# Altium project ArgoFC.PrjPcb (part 1 of 3)
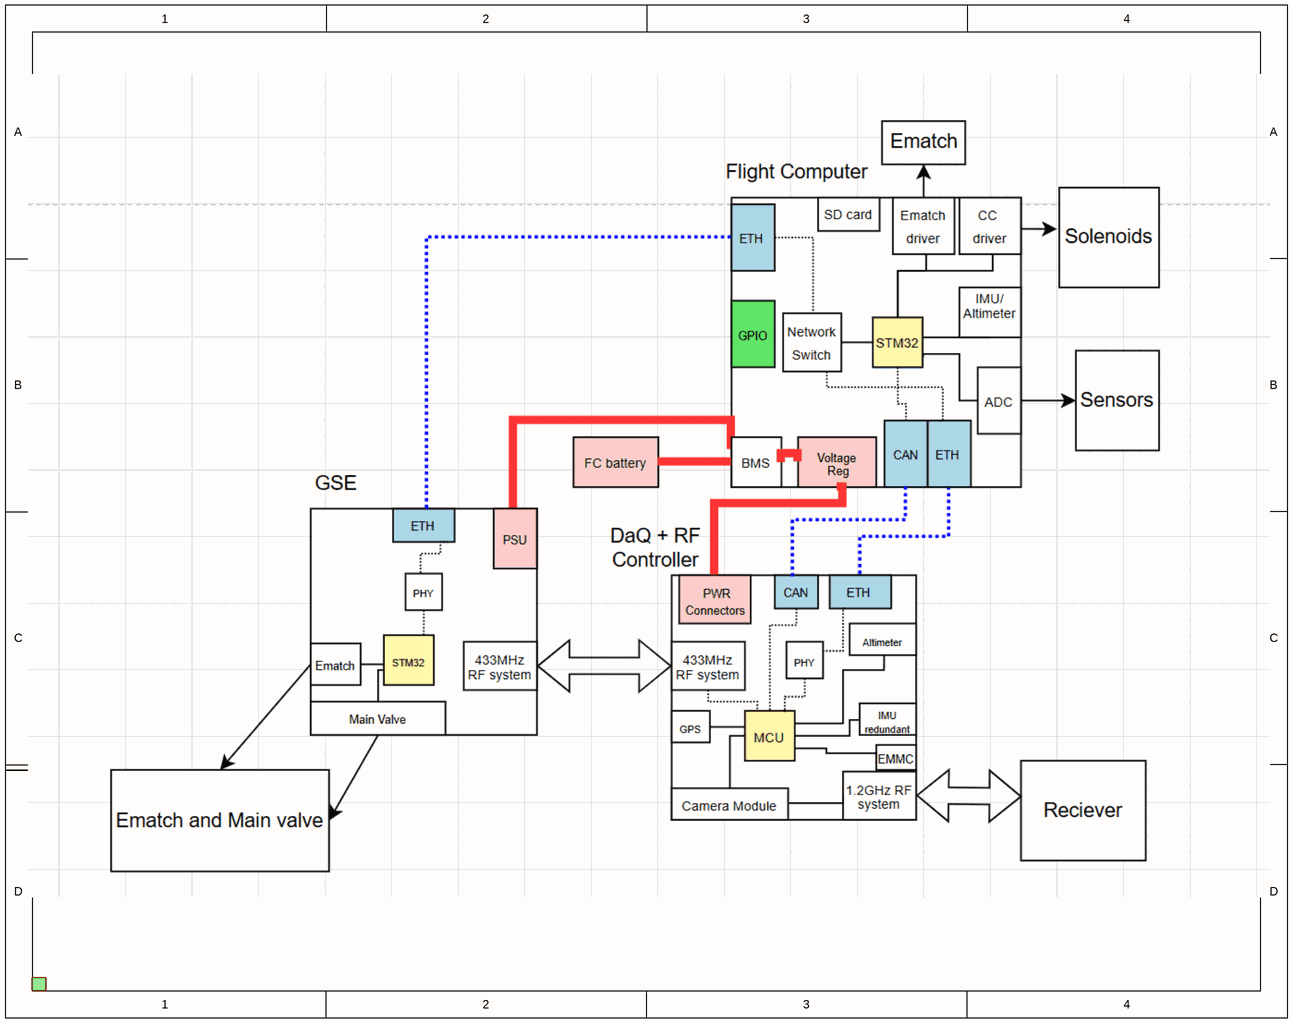
[diagram p0: CoverSheet.SchDoc]
13 sheets, 389 parts. Net scope: hierarchical (ports join the sheet entries above them; power ports are global).
Board file: ArgoFC.PcbDoc
Sheets:
  CoverSheet.SchDoc
    U_TopSheet = TopSheet.SchDoc
      U_STM32 = STM32.SchDoc
      AD7173adcModule = AD7173adcModule.SchDoc
      FlashMemory = FlashMemorySchDoc.SchDoc
      U_LoadSwitches = LoadSwitches.SchDoc
        SolenoidDriver1 = CCSolenoidDriver.SchDoc
        SolenoidDriver2 = CCSolenoidDriver.SchDoc
        SolenoidDriver3 = CCSolenoidDriver.SchDoc
        SolenoidDriver4 = CCSolenoidDriver.SchDoc
        PyroDriver1 = 24VloadSwitch.SchDoc
        PyroDriver2 = 24VloadSwitch.SchDoc
        PyroDriver3 = 24VloadSwitch.SchDoc
      U_PowerManagementModule = PowerManagementModule.SchDoc
      Designator = BoardIOModule.SchDoc
      BMS = BatteryManagementSystem.SchDoc
      Designator = CAN_Module.SchDoc
      U_KSZ8863EthernetSwitch_RMII = KSZ8863EthernetSwitch_RMII.SchDoc

## Sheet CoverSheet.SchDoc: Icarus Flight Computer
size A; Date: 11/30/2022; Revision: PRE RELEASE -- DO NOT USE; SheetNumber: 1; SheetTotal: 13

### Sub-sheets
U_TopSheet = TopSheet.SchDoc: no entries

## Sheet TopSheet.SchDoc: Icarus Flight Computer
size A; DrawnBy: J. Sullivan; Organization: ORGANIZATION; Address1: ADDRESS 1; Address2: ADDRESS 2; Address3: ADDRESS 3; Address4: ADDRESS 4; Revision: -; SheetNumber: 2; SheetTotal: 13; ENG_APP_DATE: 07/28/22; DSN_APP_DATE: --/--/--; CHK_APP_DATE: --/--/--
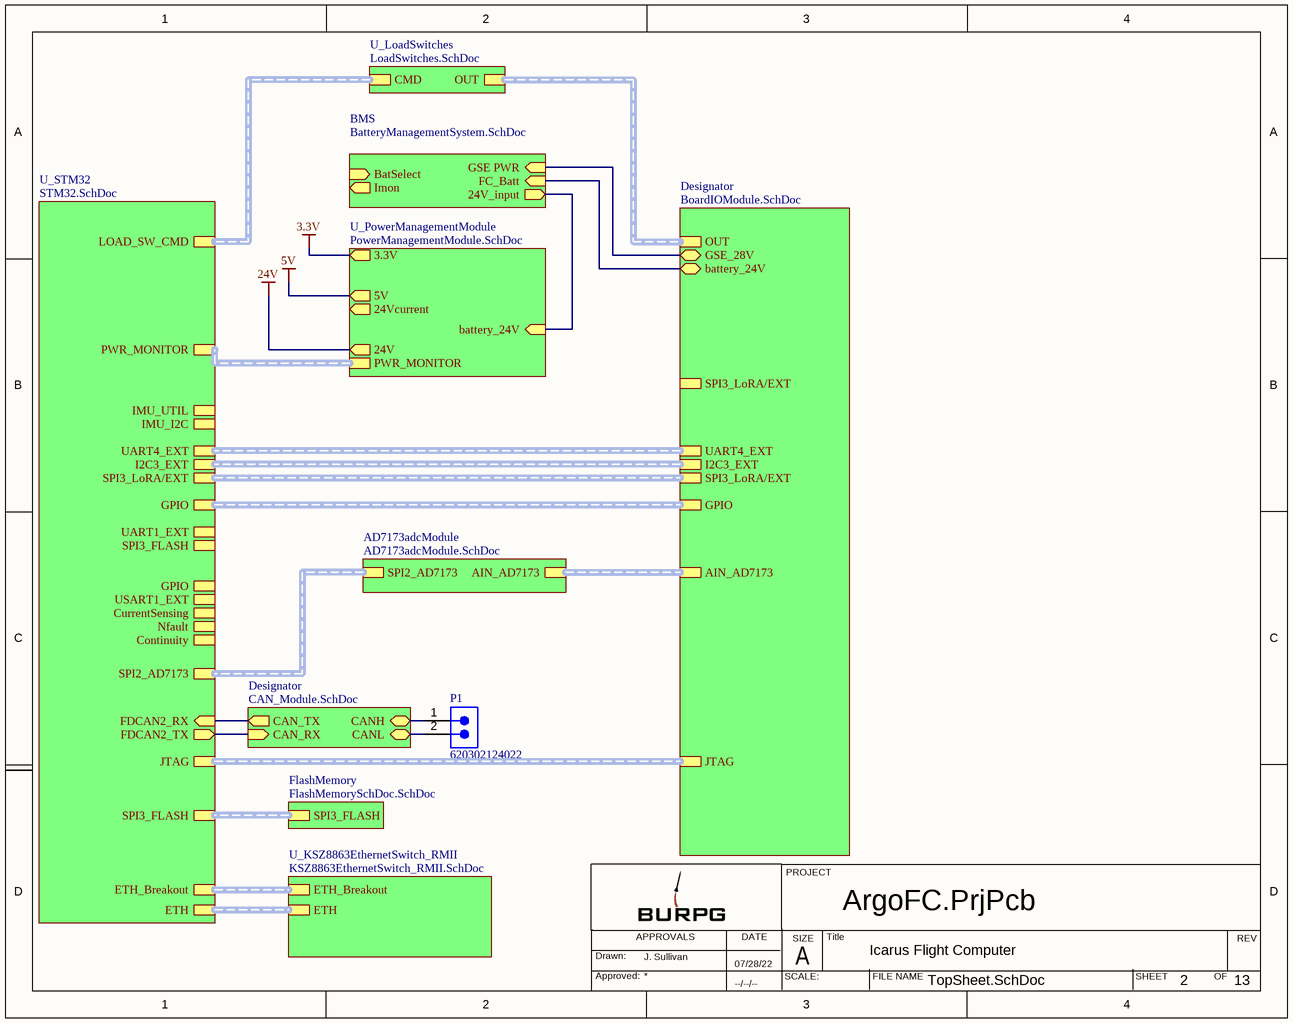
[diagram p1: TopSheet.SchDoc]

### Parts
P1  620302124022  [620302124022]

### Sub-sheets
AD7173adcModule = AD7173adcModule.SchDoc: SPI2_AD7173 (harness SPI), AIN_AD7173 (harness AIN_AD7173)
BMS = BatteryManagementSystem.SchDoc: GSE PWR (in), 24V_input (out), FC_Batt (in), BatSelect (in), Imon (out)
Designator = BoardIOModule.SchDoc: OUT (harness LOAD_SW_OUT), I2C3_EXT (harness I2C), UART4_EXT (harness UART), AIN_AD7173 (harness AIN_AD7173), SPI3_LoRA/EXT (harness SPI), JTAG (harness JTAG), GPIO, battery_24V (bidir), GSE_28V (bidir), SPI3_LoRA/EXT (harness SPI_EXT)
Designator = CAN_Module.SchDoc: CANH (bidir), CANL (bidir), CAN_RX (in), CAN_TX (out)
FlashMemory = FlashMemorySchDoc.SchDoc: SPI3_FLASH (harness LOAD_SW)
U_KSZ8863EthernetSwitch_RMII = KSZ8863EthernetSwitch_RMII.SchDoc: ETH (harness ETH), ETH_Breakout (harness SPI_ENC28J60)
U_LoadSwitches = LoadSwitches.SchDoc: CMD (harness LOAD_SW_CMD), OUT (harness LOAD_SW_OUT)
U_PowerManagementModule = PowerManagementModule.SchDoc: battery_24V (in), 24V (out), 3.3V (out), PWR_MONITOR (harness PWR_MONITOR), 24Vcurrent (out), 5V (out)
U_STM32 = STM32.SchDoc: JTAG (harness JTAG), PWR_MONITOR (harness PWR_MONITOR), UART4_EXT (harness UART), SPI3_FLASH (harness SPI), SPI2_AD7173 (harness SPI), LOAD_SW_CMD (harness LOAD_SW), IMU_I2C (harness I2C), I2C3_EXT (harness I2C), SPI3_LoRA/EXT (harness SPI), IMU_UTIL (harness IMUs), GPIO (harness *), UART1_EXT (harness UART4), SPI3_FLASH (harness SPI_FLASH), GPIO (harness GPIO), USART1_EXT (harness UART8), CurrentSensing (harness LOAD_Isense), Nfault (harness Nf), Continuity (harness Continuity), FDCAN2_RX (in), FDCAN2_TX (out), ETH (harness ETH), ETH_Breakout (harness SPI_ENC28J60)

### Nets
CANH: P1.1 ; sheet Designator/CANH
CANL: P1.2 ; sheet Designator/CANL
FDCAN2_RX: sheet U_STM32/FDCAN2_RX, sheet Designator/CAN_TX
FDCAN2_TX: sheet U_STM32/FDCAN2_TX, sheet Designator/CAN_RX
NetBMS1_7: sheet Designator/battery_24V, sheet BMS/FC_Batt
NetBMS1_9: sheet Designator/GSE_28V, sheet BMS/GSE PWR
NetC3_1: sheet U_PowerManagementModule/battery_24V, sheet BMS/24V_input

### Buses and harness runs
harness sheet AD7173adcModule/AIN_AD7173 = sheet Designator/AIN_AD7173
harness sheet AD7173adcModule/SPI2_AD7173 = sheet U_STM32/SPI2_AD7173
harness sheet Designator/GPIO = sheet U_STM32/GPIO
harness sheet Designator/I2C3_EXT = sheet U_STM32/I2C3_EXT
harness sheet Designator/JTAG = sheet U_STM32/JTAG
harness sheet Designator/OUT = sheet U_LoadSwitches/OUT
harness sheet Designator/SPI3_LoRA/EXT = sheet U_STM32/SPI3_LoRA/EXT
harness sheet Designator/UART4_EXT = sheet U_STM32/UART4_EXT
harness sheet FlashMemory/SPI3_FLASH = sheet U_STM32/SPI3_FLASH
harness sheet U_KSZ8863EthernetSwitch_RMII/ETH = sheet U_STM32/ETH
harness sheet U_KSZ8863EthernetSwitch_RMII/ETH_Breakout = sheet U_STM32/ETH_Breakout
harness sheet U_LoadSwitches/CMD = sheet U_STM32/LOAD_SW_CMD
harness sheet U_PowerManagementModule/PWR_MONITOR = sheet U_STM32/PWR_MONITOR

### Notes on the sheet
- PROJECT
- Drawn:
- Approved:
- APPROVALS
- DATE
- SCALE:
- SIZE
- A
- Title
- FILE NAME
- SHEET
- OF
- REV

### Library data of the parts
P1 = CMP-1502-00660-2: NexarPartId: 18818242; Insulation: Insulated; Connector Type: Male Pin; Pitch: 2mm; Insulation Resistance: 1GΩ; Gender: Male; Voltage Rating: 125V; Number of Positions: 2; Contact Resistance: 20mΩ; Operating Supply Voltage: 100V; Current Rating: 2A; Contact Material: Copper; Number of Rows: 1; Flammability Rating: UL94 V-0; Housing Material: Nylon; Lead Pitch: 2mm; Orientation: Vertical; Max Operating Temperature: 85°C; Termination: SMD/SMT; REACH SVHC: Unknown; Contact Mating Length: 3.5052mm; RoHS: Compliant; Packaging: Tape and Reel; Number of Contacts: 2; Height: 6.6mm; Mount: Surface Mount; Number of Pins: 2; Contact Gender: Male; Min Operating Temperature: -40°C; Length: 5mm; Width: 7.9mm; Contact Plating: Tin; Color: Beige, White

## Sheet STM32.SchDoc: Icarus MCU
size 431 x 279 mm; Date: 12/1/2022; DrawnBy: J. Sullivan; SheetNumber: 3; SheetTotal: 13; ENG_APP_DATE: 12/01/2022; DSN_APP_DATE: --/--/--; CHK_APP_DATE: --/--/--; SPICEModelCacheYFKOITNE: <root> / <DocumentId>YFKOITNE</DocumentId> / </root>
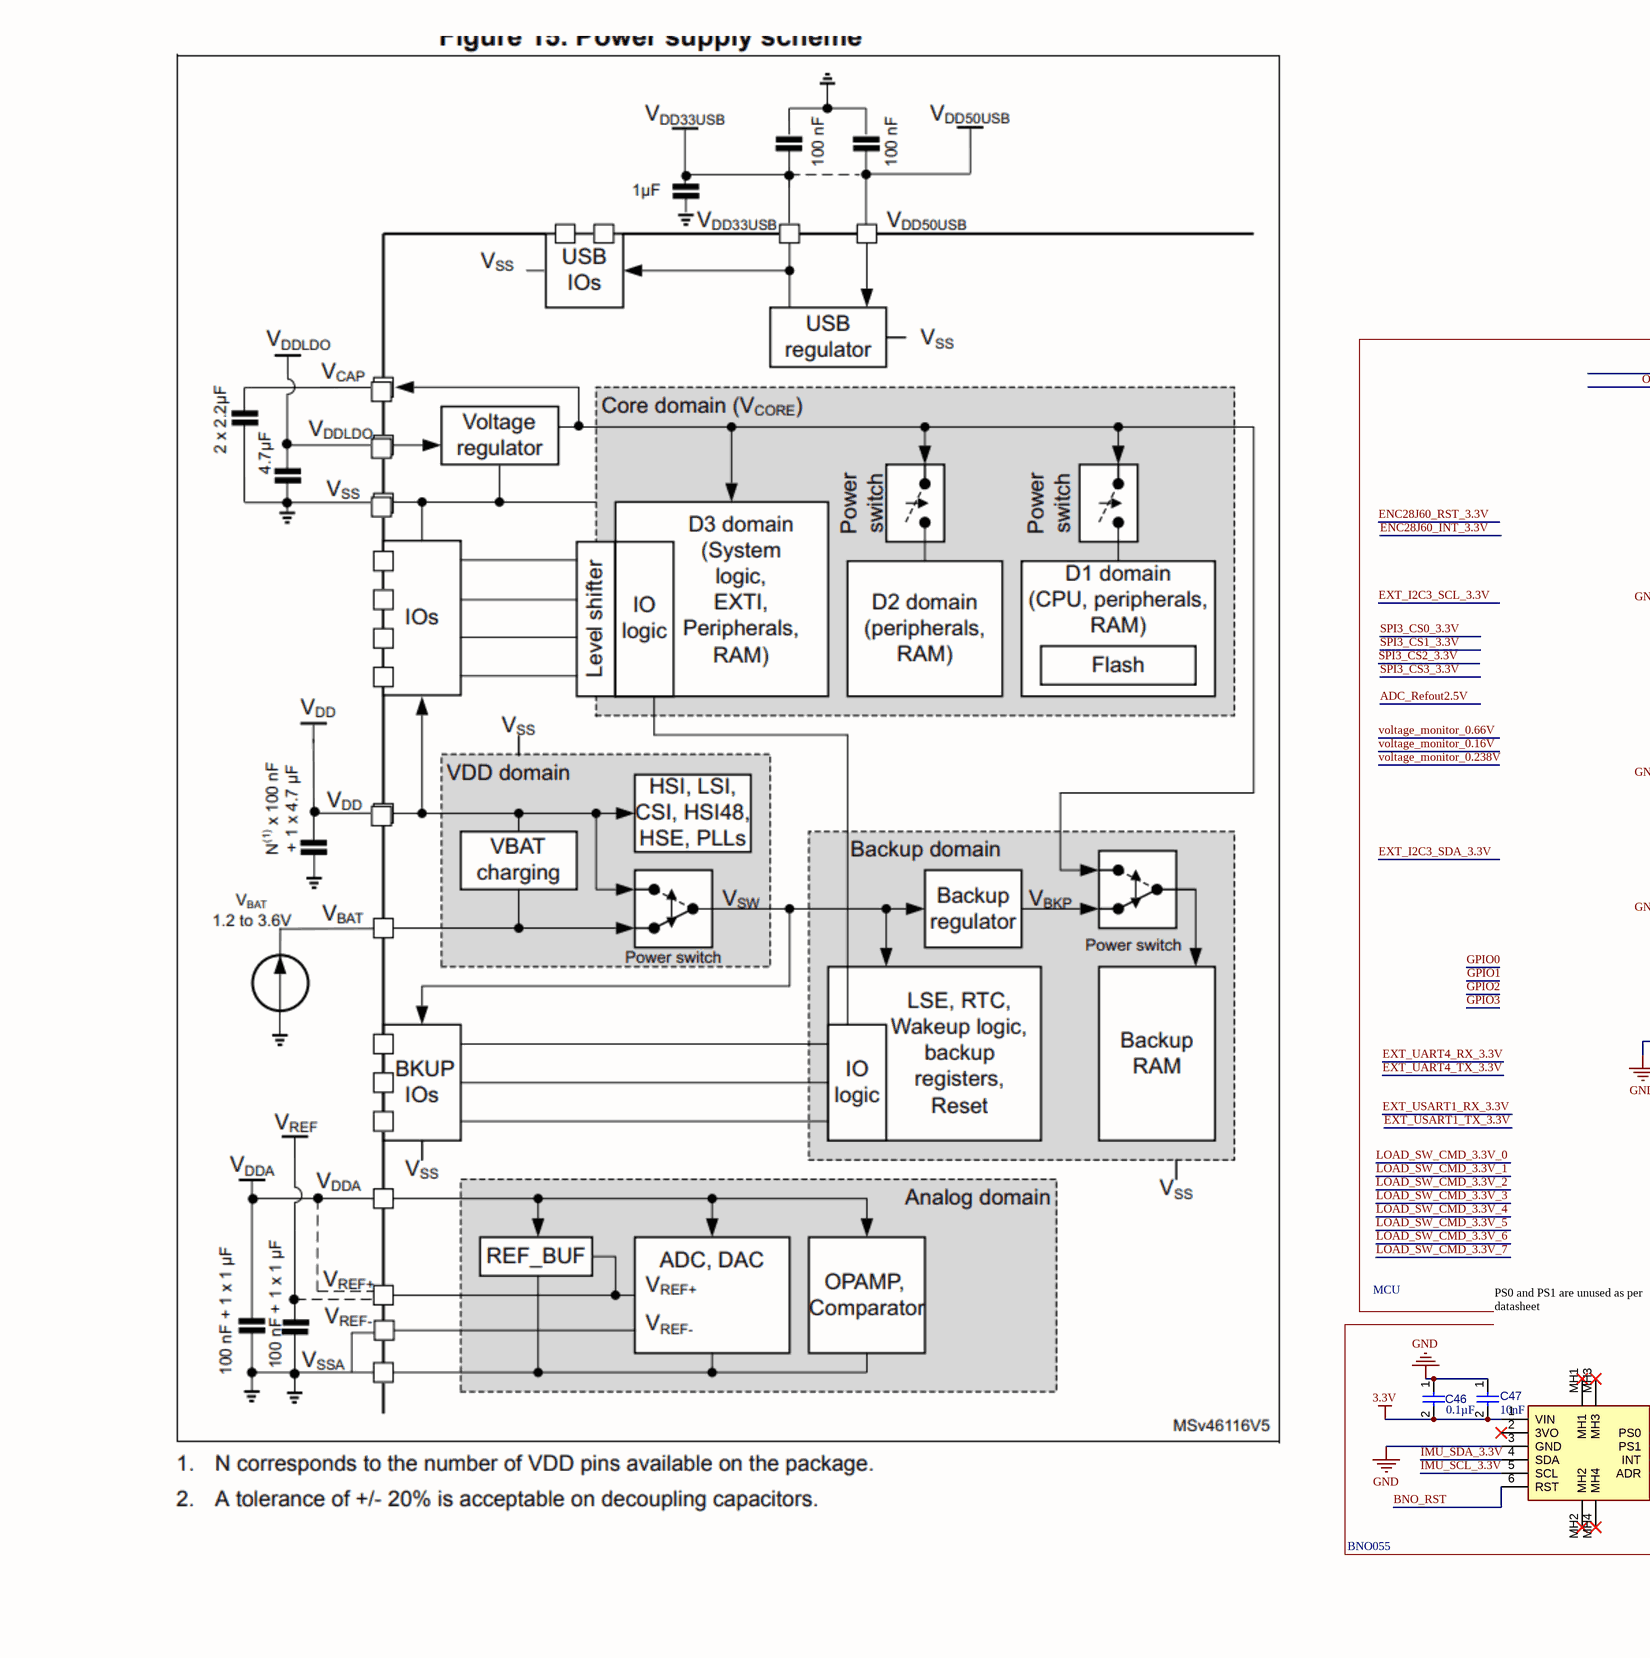
[diagram p2: STM32.SchDoc, left]
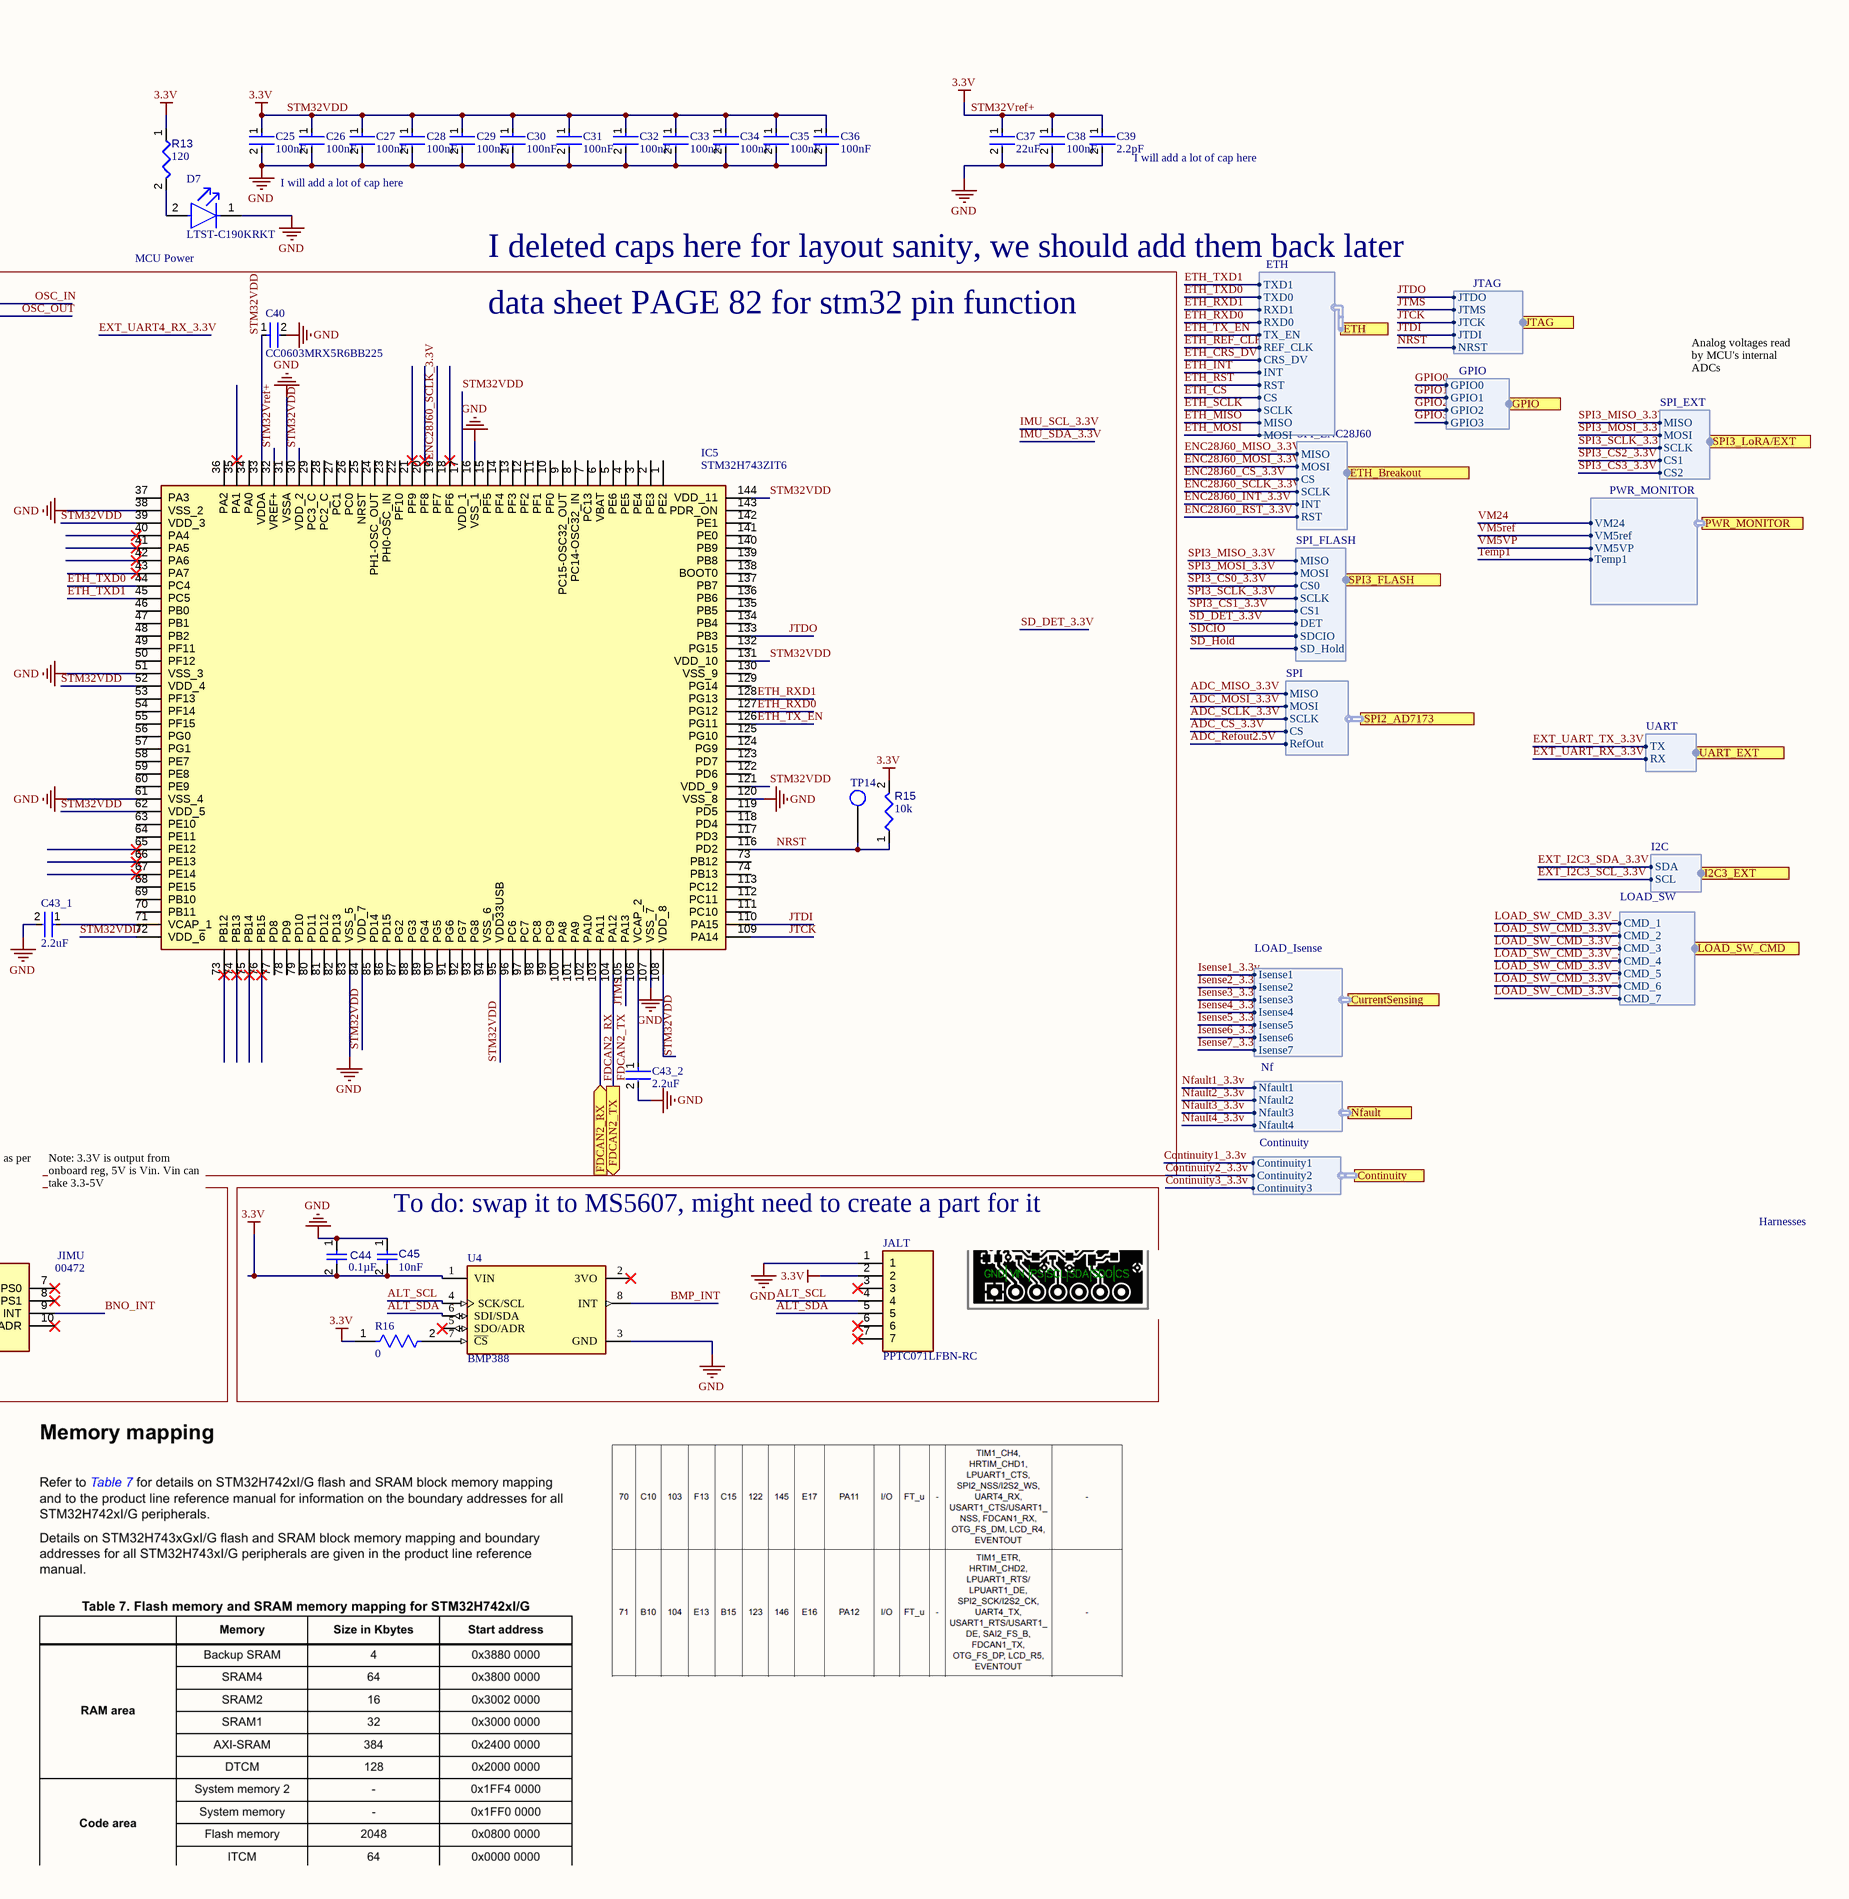
[diagram p3: STM32.SchDoc, right]

### Parts
C25  100nF  [FP-CC0402-MFG]
C26  100nF  [FP-CC0402-MFG]
C27  100nF  [FP-CC0402-MFG]
C28  100nF  [FP-CC0402-MFG]
C29  100nF  [FP-CC0402-MFG]
C30  100nF  [FP-CC0402-MFG]
C31  100nF  [FP-CC0402-MFG]
C32  100nF  [FP-CC0402-MFG]
C33  100nF  [FP-CC0402-MFG]
C34  100nF  [FP-CC0402-MFG]
C35  100nF  [FP-CC0402-MFG]
C36  100nF  [FP-CC0402-MFG]
C37  22uF  [FP-CC0603-DA-MFG]
C38  100nF  [FP-CGA3E-0_3-0_1-IPC_A]
C39  2.2pF  [FP-C0603C-CF-MFG]
C40  CC0603MRX5R6BB225  [FP-CC0603-DA-MFG]
C43_1  2.2uF  [FP-CC0603-DA-MFG]
C43_2  2.2uF  [FP-CC0603-DA-MFG]
C44  value 0.1µF  [CAPC1608X90X40LL10T20]  (hidden comment: Capacitor 1 uF +/- 10% 25 V 0603)
C45  value 10nF  [CAPC1608X90X40NL10T20]  (hidden comment: Capacitor 100 nF +/-10% 50 V 0603)
C46  value 0.1µF  [CAPC1608X90X40LL10T20]  (hidden comment: Capacitor 1 uF +/- 10% 25 V 0603)
C47  value 10nF  [CAPC1608X90X40NL10T20]  (hidden comment: Capacitor 100 nF +/-10% 50 V 0603)
D7  LTST-C190KRKT  [FP-LTST-C190KRKT-MFG]
IC5  STM32H743ZIT6  [QFP50P2200X2200X160-144N]
JALT  PPTC071LFBN-RC  [RHDR7W80P0X254_1X7_1828X254X870P]
JIMU  00472  [00472]
R13  value 120  [RESC1609X50X30ML08T20]  (hidden comment: Resistor 20R +/-1% 0603 100 mW)
R15  value 10k  [RESC0402(1005)_L]  (hidden comment: 10KR2F)
R16  0  [FP-CRCW1206-e3-MFG]
TP14  BURPG_TestPoint1  [BURPG_TestPoint1]  (value not drawn)  (no BOM)
U4  BMP388  [FP-3966-MFG]

### Blocks framed on the sheet
data sheet PAGE 82 for stm32 pin function: C40 C43_1 C43_2 IC5 R15 TP14
BNO055: C46 C47 JIMU
To do: swap it to MS5607, might need to create a part for it: C44 C45 JALT R16 U4

### Ports
Continuity (harness Continuity), CurrentSensing (harness LOAD_Isense), ETH (harness ETH), ETH_Breakout (harness SPI_ENC28J60), FDCAN2_RX (in), FDCAN2_TX (out), GPIO (harness GPIO), I2C3_EXT (harness I2C), JTAG (harness JTAG), LOAD_SW_CMD (harness LOAD_SW), Nfault (harness Nf), PWR_MONITOR (harness PWR_MONITOR), SPI2_AD7173 (harness SPI), SPI3_FLASH (harness SPI_FLASH), SPI3_LoRA/EXT (harness SPI_EXT), UART_EXT (harness UART)

### Harnesses
JTAG: JTDO, JTMS, JTCK, JTDI, NRST
UART: TX, RX
SPI_ENC28J60: MISO, MOSI, CS, SCLK, INT, RST
LOAD_SW: CMD_1, CMD_2, CMD_3, CMD_4, CMD_5, CMD_6, CMD_7
I2C: SDA, SCL
SPI_EXT: MISO, MOSI, CS1, SCLK, CS2
PWR_MONITOR: VM24, VM5ref, VM5VP, Temp1
GPIO: GPIO0, GPIO1, GPIO2, GPIO3
SPI_FLASH: MISO, MOSI, CS0, SCLK, CS1, DET, SDCIO, SD_Hold
SPI: MISO, MOSI, CS, SCLK, RefOut
LOAD_Isense: Isense1, Isense2, Isense3, Isense4, Isense5, Isense6, Isense7
Nf: Nfault1, Nfault2, Nfault3, Nfault4
Continuity: Continuity1, Continuity2, Continuity3
ETH: RXD0, RXD1, TXD0, TXD1, TX_EN, REF_CLK, CRS_DV, INT, RST, CS, SCLK, MISO, MOSI

### Nets
GND: C25.2 C26.2 C27.2 C28.2 C29.2 C30.2 C31.2 C32.2 C33.2 C34.2 C35.2 C36.2 C37.2 C38.2 C39.2 C40.2 C43_1.2 C43_2.2 C44.1 C45.1 C46.1 C47.1 D7.1(C) IC5.16(VSS_1) IC5.31(VSSA) IC5.38(VSS_2) IC5.51(VSS_3) IC5.61(VSS_4) IC5.83(VSS_5) IC5.107(VSS_7) IC5.120(VSS_8) JALT.1 JIMU.3(GND) U4.3(GND)
STM32VDD: C25.1 C26.1 C27.1 C28.1 C29.1 C30.1 C31.1 C32.1 C33.1 C34.1 C35.1 C36.1 C37.1 C38.1 C39.1 C40.1 C44.2 C45.2 C46.2 C47.2 IC5.17(VDD_1) IC5.30(VDD_2) IC5.32(VREF+) IC5.33(VDDA) IC5.39(VDD_3) IC5.52(VDD_4) IC5.62(VDD_5) IC5.72(VDD_6) IC5.84(VDD_7) IC5.95(VDD33USB) IC5.108(VDD_8) IC5.121(VDD_9) IC5.131(VDD_10) IC5.144(VDD_11) JALT.2 JIMU.1(VIN) R13.1 R15.2 R16.1 U4.1(VIN)  [also labelled 3.3V, STM32Vref+]
ALT_SCL: JALT.4 U4.4(SCK/SCL)
ALT_SDA: JALT.5 U4.6(SDI/SDA)
BMP_INT: U4.8(INT)
BNO_INT: JIMU.9(INT)
BNO_RST: JIMU.6(RST)
Continuity1_3.3v: port Continuity.Continuity1
Continuity2_3.3v: port Continuity.Continuity2
Continuity3_3.3v: port Continuity.Continuity3
ENC28J60_SCLK_3.3V: IC5.19(PF7) ; port ETH_Breakout.SCLK
ETH_CS: port ETH.CS
ETH_INT: port ETH.INT
ETH_MISO: port ETH.MISO
ETH_MOSI: port ETH.MOSI
ETH_RST: port ETH.RST
ETH_RXD0: IC5.127(PG12) ; port ETH.RXD0
ETH_RXD1: IC5.128(PG13) ; port ETH.RXD1
ETH_SCLK: port ETH.SCLK
ETH_TX_EN: IC5.126(PG11) ; port ETH.TX_EN
ETH_TXD0: IC5.44(PC4) ; port ETH.TXD0
ETH_TXD1: IC5.45(PC5) ; port ETH.TXD1
EXT_I2C3_SCL_3.3V: port I2C3_EXT.SCL
EXT_I2C3_SDA_3.3V: port I2C3_EXT.SDA
EXT_UART_RX_3.3V: port UART_EXT.RX
EXT_UART_TX_3.3V: port UART_EXT.TX
FDCAN2_RX: IC5.103(PA11) ; port FDCAN2_RX
FDCAN2_TX: IC5.104(PA12) ; port FDCAN2_TX
IMU_SCL_3.3V: JIMU.5(SCL)
IMU_SDA_3.3V: JIMU.4(SDA)
Isense1_3.3v: port CurrentSensing.Isense1
Isense2_3.3v: port CurrentSensing.Isense2
Isense3_3.3v: port CurrentSensing.Isense3
Isense4_3.3v: port CurrentSensing.Isense4
Isense5_3.3v: port CurrentSensing.Isense5
Isense6_3.3v: port CurrentSensing.Isense6
Isense7_3.3v: port CurrentSensing.Isense7
JTCK: IC5.109(PA14) ; port JTAG.JTCK
JTDI: IC5.110(PA15) ; port JTAG.JTDI
JTDO: IC5.133(PB3) ; port JTAG.JTDO
JTMS: IC5.105(PA13) ; port JTAG.JTMS
Nfault1_3.3v: port Nfault.Nfault1
Nfault2_3.3v: port Nfault.Nfault2
Nfault3_3.3v: port Nfault.Nfault3
Nfault4_3.3v: port Nfault.Nfault4
NRST: IC5.116(PD2) R15.1 TP14.1 ; port JTAG.NRST
SPI3_CS2_3.3V: port SPI3_LoRA/EXT.CS1
SPI3_CS3_3.3V: port SPI3_LoRA/EXT.CS2
SPI3_MISO_3.3V: port SPI3_LoRA/EXT.MISO, port SPI3_FLASH.MISO
SPI3_MOSI_3.3V: port SPI3_LoRA/EXT.MOSI, port SPI3_FLASH.MOSI
SPI3_SCLK_3.3V: port SPI3_LoRA/EXT.SCLK, port SPI3_FLASH.SCLK
VM5ref: port PWR_MONITOR.VM5ref
VM5VP: port PWR_MONITOR.VM5VP
NetC43_1_1: C43_1.1 IC5.71(VCAP_1)
NetC43_2_1: C43_2.1 IC5.106(VCAP_2)
NetD7_2: D7.2(A) R13.2
NetR16_2: R16.2 U4.7(~{CS})

Not connected (* = marked no-connect by the designer): IC5 1(PE2) 2(PE3) 3(PE4) 4(PE5) 5(PE6) 6(VBAT) 7(PC13) 8(PC14-OSC32_IN) 9(PC15-OSC32_OUT) 10(PF0) 11(PF1) 12(PF2) 13(PF3) 14(PF4) 15(PF5) 18(PF6)* 20(PF8)* 21(PF9)* 22(PF10) 23(PH0-OSC_IN) 24(PH1-OSC_OUT) 25(NRST) 26(PC0) 27(PC1) 28(PC2_C) 29(PC3_C) 34(PA0) 35(PA1)* 36(PA2) 37(PA3) 40(PA4)* 41(PA5)* 42(PA6)* 43(PA7)* 46(PB0) 47(PB1) 48(PB2) 49(PF11) 50(PF12) 53(PF13) 54(PF14) 55(PF15) 56(PG0) 57(PG1) 58(PE7) 59(PE8) 60(PE9) 63(PE10) 64(PE11) 65(PE12)* 66(PE13)* 67(PE14)* 68(PE15) 69(PB10) 70(PB11) 73(PB12)* 74(PB13)* 75(PB14)* 76(PB15)* 77(PD8) 78(PD9) 79(PD10) 80(PD11) 81(PD12) 82(PD13) 85(PD14) 86(PD15) 87(PG2) 88(PG3) 89(PG4) 90(PG5) 91(PG6) 92(PG7) 93(PG8) 94(VSS_6) 96(PC6) 97(PC7) 98(PC8) 99(PC9) 100(PA8) 101(PA9) 102(PA10) 111(PC10) 112(PC11) 113(PC12) 117(PD3) 118(PD4) 119(PD5) 122(PD6) 123(PD7) 124(PG9) 125(PG10) 129(PG14) 130(VSS_9) 132(PG15) 134(PB4) 135(PB5) 136(PB6) 137(PB7) 138(BOOT0) 139(PB8) 140(PB9) 141(PE0) 142(PE1) 143(PDR_ON); JALT 3* 6* 7*; JIMU 2(3VO)* 7(PS0)* 8(PS1)* 10(ADR)* MH1* MH2* MH3* MH4*; U4 2(3VO)* 5(SDO/ADR)*

### Notes on the sheet
- I will add a lot of cap here
- (near C39) I will add a lot of cap here
- (near D7) MCU Power
- I deleted caps here for layout sanity, we should add them back later
- Analog voltages read by MCU's internal ADCs
- MCU
- PS0 and PS1 are unused as per datasheet
- Note: 3.3V is output from onboard reg, 5V is Vin. Vin can take 3.3-5V
- Harnesses
- DWG. NO.
- REV.
- SHT.
- THIS DOCUMENT AND THE DATA DISCLOSED HEREIN OR HEREWITH IS THE PROPERTY OF ALTIUM LIMITED AND MAY BE FREELY DISTRIBUTED IN WHOLE. NO RIGHTS ARE RESERVED OR EXPRESS OR IMPLIED WARANTEE GIVEN.
- REVISION
- DESCRIPTION
- DATE
- APPROVED
- ENG:
- APPROVALS
- PROJECT
- DSN:
- CHK:
- REFERENCE DOCUMENTS
- PROJECT REVISION:
- TITLE
- DOCUMENT REVISION:
- DESIGN ITEM:
- BOM:
- FAB DWG:
- PCB DWG:
- ASSY DWG:
- SCALE:
- SIZE
- B
- CAGE CODE
- FILE NAME
- DWG NO.
- SHEET
- OF
- REV

### Library data of the parts
C25-C36 = CMP-03422-000048-1: CAP CER 0.1UF 16V X7R 0402; Manufacturer: YAGEO; Manufacturer Part Number: CC0402KRX7R7BB104; Material: Ceramic; Automotive Grade: NA; Temperature Coefficient: 30ppm/°C; Tolerance: 0.1; Device Class L1: Passive Components; Temperature Range Low: -55°C; Device Class L3: Ceramic Capacitors; Temperature Characteristic: X7R; Ipc Land Pattern Name: CAPC10050X50; Capacitance: 100 nF; Temperature Range High: +125°C; Voltage Rating: 16 V; Temperature: -55°C to +125°C; RoHS: TRUE; Automotive: No; Height: 0.55mm; Device Class L2: Capacitors; Digikey Description: CAP CER 0.1UF 16V X7R 0402; Package: CC0402; Footprint Url: http://www.yageo.com/exep/pages/download/literatures/UPY-C_GEN_24.pdf; ComponentLink2Description: Datasheet; Category: Cap; Lead Free: Yes; Value: 100 nF; Octopart: https://octopart.com/cc0402krx7r7bb104-yageo-42244624; ComponentLink2URL: http://www.yageo.com/documents/recent/UPY-GP_NP0_16V-to-50V_16.pdf; Mouser Description: 0402 0.1 uF 16 V ±10 % Tolerance X7R SMT Multilayer Ceramic Capacitor
C37 C43_1 C43_2 = CMP-03422-000441-1: CAP CER 2.2UF 10V X5R 0603; Manufacturer Part Number: CC0603MRX5R6BB225; Manufacturer: YAGEO; Material: Ceramic; Tolerance: 0.2; Temperature Coefficient: 15%; Temperature Characteristic: X5R; Device Class L2: Capacitors; Octopart: https://octopart.com/cc0603mrx5r6bb225-yageo-40952238; Digikey Description: CAP CER 2.2UF 10V X5R 0603; Footprint Url: http://www.yageo.com/exep/pages/download/literatures/UPY-C_GEN_24.pdf; ComponentLink2URL: http://www.yageo.com/documents/recent/UPY-GPHC_X7R_6.3V-to-50V_18.pdf; ComponentLink2Description: Datasheet; Device Class L1: Passive Components; Height: 0.9mm; Category: Cap; Device Class L3: Ceramic Capacitors; Temperature Range High: +125°C; Value: 2.2 uF; Automotive: No; Package: CC0603-DA; Mouser Description: Multilayer Ceramic Capacitors MLCC - SMD/SMT 2.2uF 10V X5R 20%; Temperature: -55°C to +125°C; Temperature Range Low: -55°C; RoHS: TRUE; Lead Free: Yes; Voltage Rating: 10 V; Capacitance: 2.2 uF; Voltage: 10 V
C38 = CMP-2000-07546-2: Cap Ceramic 100nF 50V X7R 10% Pad SMD 0603 +125°C Automotive T/R; Weight: 7.1E-05oz; Composition: Ceramic; Max Operating Temperature: 125°C; Termination: SMD/SMT; Dielectric: X7R; Length: 1.6mm; Package Quantity: 1; REACH SVHC: No SVHC; Lead Free: Lead Free; Case Code (Metric): 1608; Min Operating Temperature: -55°C; Packaging: Tape and Reel; Tolerance: 10%; Voltage Rating: 50V; Case Code (Imperial): 0603; Capacitance: 100nF; Case/Package: 0603; Voltage Rating (DC): 50V; Depth: 0.8mm; Radiation Hardening: No; Ratings: AEC-Q200; Mount: Surface Mount; Voltage: 50V; Thickness: 0.035inch; Width: 0.8mm; Height: 0.8mm
C39 = CMP-1035-00158-3: CAP CER 2.2PF 50V NP0 0603; Manufacturer Part Number: C0603C229C5GACTU; Manufacturer: KEMET; Automotive Grade: Grade 1; Temperature Coefficient: 30ppm/°C; Temperature Characteristic: C0G; Tolerance: 0.25 pF; Material: Ceramic; Lead Free: Yes; Value: 2.2 pF; Voltage Rating: 50 V; Package: C0603C-CF; Category: Cap; RoHS: TRUE; ComponentLink2Description: Datasheet; Capacitance: 2.2 pF; Device Class L2: Capacitors; Digikey Description: CAP CER 2.2PF 50V NP0 0603; Temperature: -55°C to +125°C; Temperature Range Low: -55°C; Mouser Description: Multilayer Ceramic Capacitors MLCC - SMD/SMT 50volts 2.2pF C0G 0.25%; ComponentLink2URL: https://api.kemet.com/component-edge/download/datasheet/C0603C100J5GACAUTO.pdf; Temperature Range High: +125°C; Height: 0.87mm; Automotive: Yes; Device Class L1: Passive Components; Octopart: https://octopart.com/c0603c229c5gactu-kemet-3874912; Device Class L3: Ceramic Capacitors
C40 = CMP-03422-000441-1: CAP CER 2.2UF 10V X5R 0603; Manufacturer: YAGEO; Material: Ceramic; Tolerance: 0.2; Temperature Coefficient: 15%; Temperature Characteristic: X5R; Device Class L2: Capacitors; Octopart: https://octopart.com/cc0603mrx5r6bb225-yageo-40952238; Digikey Description: CAP CER 2.2UF 10V X5R 0603; Footprint Url: http://www.yageo.com/exep/pages/download/literatures/UPY-C_GEN_24.pdf; ComponentLink2URL: http://www.yageo.com/documents/recent/UPY-GPHC_X7R_6.3V-to-50V_18.pdf; ComponentLink2Description: Datasheet; Device Class L1: Passive Components; Height: 0.9mm; Category: Cap; Device Class L3: Ceramic Capacitors; Temperature Range High: +125°C; Value: 2.2 uF; Manufacturer Part Number: CC0603MRX5R6BB225; Automotive: No; Package: CC0603-DA; Mouser Description: Multilayer Ceramic Capacitors MLCC - SMD/SMT 2.2uF 10V X5R 20%; Temperature: -55°C to +125°C; Temperature Range Low: -55°C; RoHS: TRUE; Lead Free: Yes; Voltage Rating: 10 V; Capacitance: 2.2 uF; Voltage: 10 V
C44 C46 = CMP-001-00005-6: Chip Capacitor, 1 uF, +/- 10%, 25 V, 0603 (1608 Metric); Capacitor Type: Ceramic; Voltage Rating: 25V; Pins: 2; Mounting Technology: SM; RoHS Compliant: True; Max Operating Temperature: 125°C; Case/Package: 0603; Min Operating Temperature: -55°C; Tolerance: 10%
C45 C47 = CMP-001-00017-6: Chip Capacitor, 100 nF, +/- 10%, 50 V, 0603 (1608 Metric); Voltage Rating: 50V; Capacitor Type: Ceramic; Tolerance: 10%; Mounting Technology: SM; Max Operating Temperature: 125°C; RoHS Compliant: True; Pins: 2; Case/Package: 0603; Min Operating Temperature: -55°C
D7 = CMP-1674-00011-2: LED RED CLEAR CHIP SMD; Reverse Voltage: 5V; Viewing Angle: 130°; Power Rating: 75mW; Test Current: 20mA; Number of Elements: 1; Lens Color: Colorless; Wavelength: 639nm; Dominant Wavelength: 631nm; Lens Style: Diffused; Forward Current: 30mA; Forward Voltage: 2.4V; Luminous Intensity: 54mcd; Color: Red; Case Code (Imperial): 0603; Lens Transparency: Clear; Lead Free: Lead Free; Package Quantity: 1; Packaging: Tape and Reel; Max Operating Temperature: 85°C; Number of Pins: 2; Height: 0.8mm; Case/Package: 0603; Number of LEDs: 1; Width: 0.8mm; Case Code (Metric): 1608; Depth: 0.8mm; Mount: Surface Mount; Radiation Hardening: No; Length: 1.6mm; Illumination Color: Red; Power Dissipation: 75mW; Min Operating Temperature: -55°C
IC5 = STM32H743ZIT6: Integrated Circuit / https://www.allelcoelec.com/productdetails/STMicroelectronics/STM32H743ZIT6.html?gad_source=1&gad_campaignid=21002909653&gclid=CjwKCAjw4efDBhATEiwAaDBpbvLpcbmne3WKOXgEcIaqaVpz5lcgSvxb9vCyHUjI6dfgnmkW9JZCHhoCY-cQAvD_BwE; Datasheet Link: https://www.st.com/resource/en/datasheet/stm32h743zi.pdf; Height: 1.6mm; Manufacturer_Name: STMicroelectronics; Manufacturer_Part_Number: STM32H743ZIT6; Mouser Part Number: 511-STM32H743ZIT6; Mouser Price/Stock: https://www.mouser.co.uk/ProductDetail/STMicroelectronics/STM32H743ZIT6?qs=FNcb6ahWXRyuf15GdgTu%252Bw%3D%3D; Arrow Part Number: STM32H743ZIT6; Arrow Price/Stock: https://www.arrow.com/en/products/stm32h743zit6/stmicroelectronics?utm_currency=USD&region=nac
JALT = PPTC071LFBN-RC: Connector; Manufacturer_Name: Sullins; Datasheet Link: https://drawings-pdf.s3.amazonaws.com/10492.pdf; Height: 8.7mm; Manufacturer_Part_Number: PPTC071LFBN-RC
JIMU = 00472: Connector; Manufacturer_Name: Adafruit; Datasheet Link: https://learn.adafruit.com/downloads/pdf/adafruit-bno055-absolute-orientation-sensor.pdf; Height: 2mm; Manufacturer_Part_Number: 00472
R13 = CMP-009-00199-1: Chip Resistor, 20 Ohm, +/- 1%, 100 mW, -55 to 155 degC, 0603 (1608 Metric); Power: 100mW; Voltage Rating: 75V; RoHS Compliant: True; Tolerance: 1%; Mounting Technology: SM; Min Operating Temperature: -55°C; Pins: 2; Max Operating Temperature: 155°C; Case/Package: 0603
R15 = CMP-009-00066-2: 10K 0.063W 1% 0402 (1005 Metric)  SMD; Power: 63mW; Case/Package: 0402; Mounting Technology: SMT; Pins: 2; Tolerance: 1%
R16 = CMP-2003-04797-2: RES Thick Film, 0Ω, 0.25W, 1206; Voltage Rating: 200V; Power Rating: 250mW; Resistance: 0mR; Depth: 1.6mm; Case/Package: 1206; Termination: SMD/SMT; Military Standard: Not; Length: 3.2mm; Height: 0.024inch; Number of Terminations: 2; Case Code (Metric): 3216; Width: 0.063inch; Features: Automotive AEC-Q200; Max Operating Temperature: 155°C; Min Operating Temperature: -55°C; Voltage Rating (DC): 200V; Contact Plating: Tin; Max Power Dissipation: 250mW; Radiation Hardening: No; Packaging: Tape and Reel; Package Quantity: 10000; Composition: Thick Film; Weight: 0.000353oz; Case Code (Imperial): 1206; Lead Free: Lead Free
U4 = CMP-144239-000001-1: BMP388 - PRECISION BAROMETRIC PR

## Sheet AD7173adcModule.SchDoc
size 431 x 279 mm; SheetNumber: 4; SheetTotal: 13
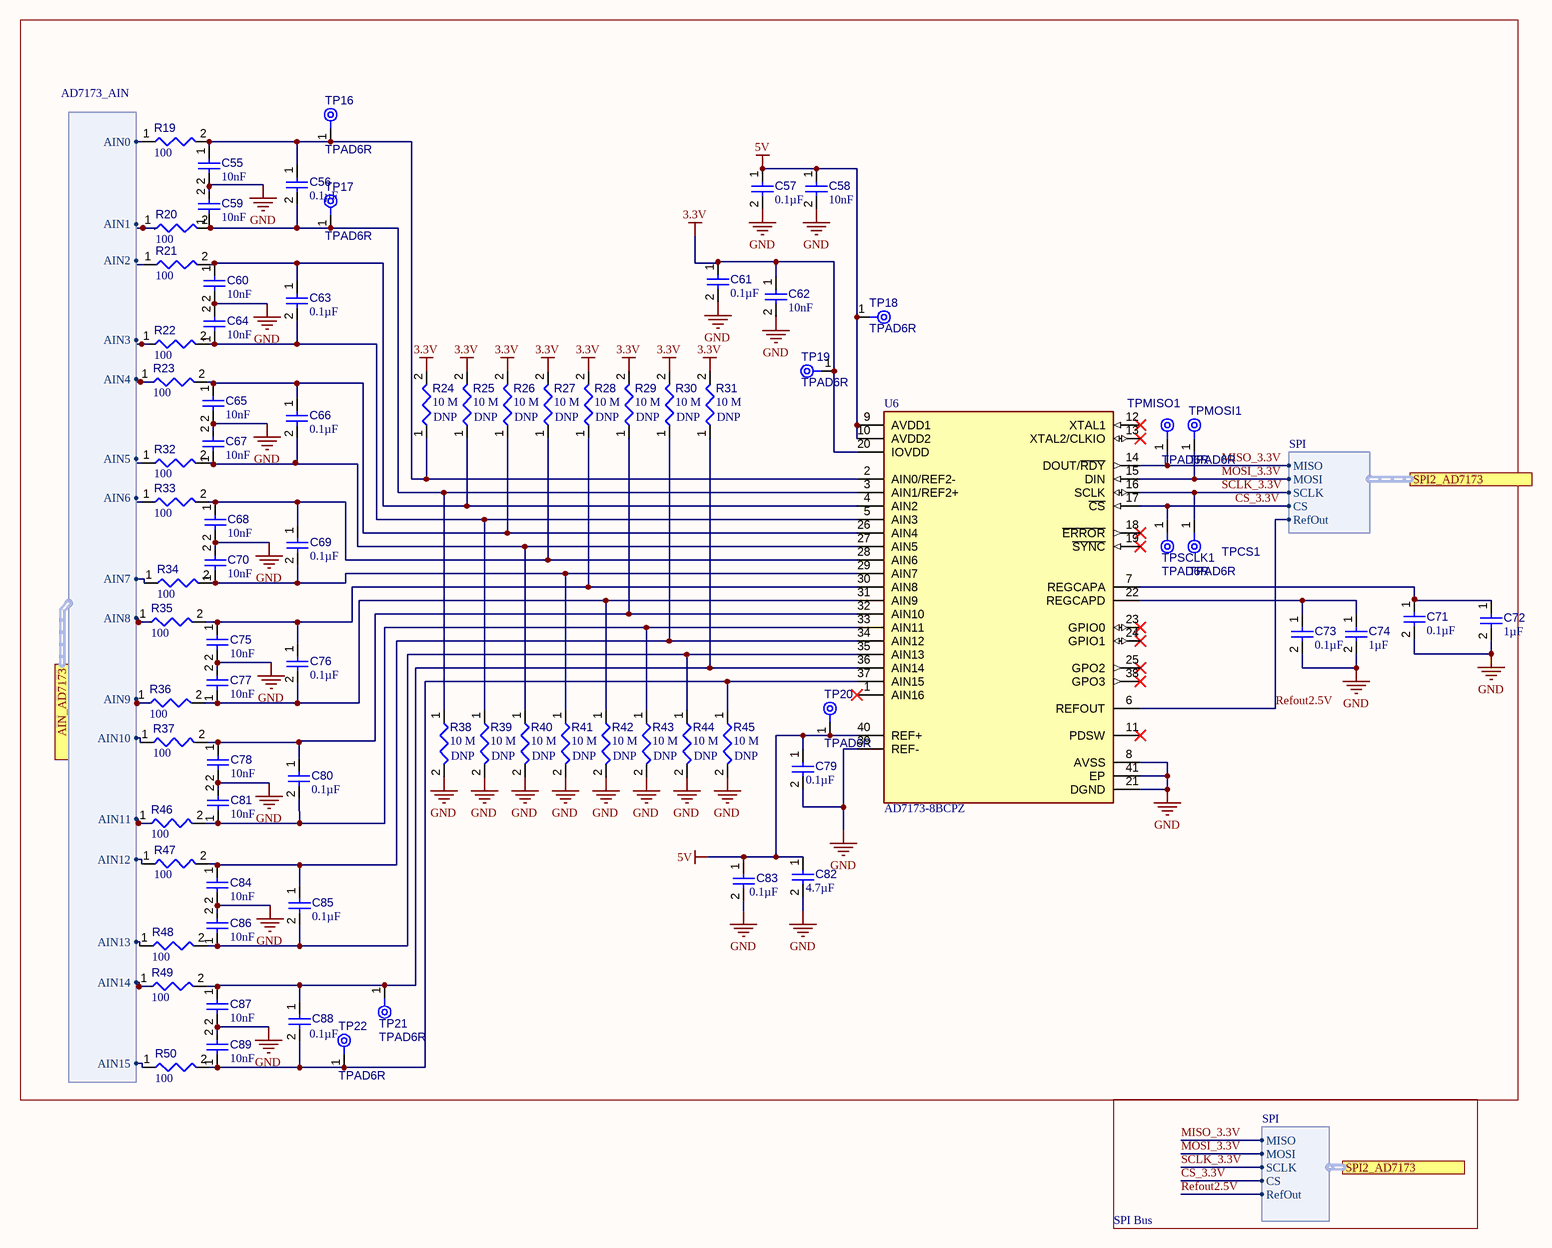
[diagram p4: AD7173adcModule.SchDoc]

### Parts
C55  value 10nF  [CAPC1608X90X40NL10T20]  (hidden comment: Capacitor 100 nF +/-10% 50 V 0603)
C56  value 0.1µF  [CAPC1608X90X40LL10T20]  (hidden comment: Capacitor 1 uF +/- 10% 25 V 0603)
C57  value 0.1µF  [CAPC1608X90X40LL10T20]  (hidden comment: Capacitor 1 uF +/- 10% 25 V 0603)
C58  value 10nF  [CAPC1608X90X40NL10T20]  (hidden comment: Capacitor 100 nF +/-10% 50 V 0603)
C59  value 10nF  [CAPC1608X90X40NL10T20]  (hidden comment: Capacitor 100 nF +/-10% 50 V 0603)
C60  value 10nF  [CAPC1608X90X40NL10T20]  (hidden comment: Capacitor 100 nF +/-10% 50 V 0603)
C61  value 0.1µF  [CAPC1608X90X40LL10T20]  (hidden comment: Capacitor 1 uF +/- 10% 25 V 0603)
C62  value 10nF  [CAPC1608X90X40NL10T20]  (hidden comment: Capacitor 100 nF +/-10% 50 V 0603)
C63  value 0.1µF  [CAPC1608X90X40LL10T20]  (hidden comment: Capacitor 1 uF +/- 10% 25 V 0603)
C64  value 10nF  [CAPC1608X90X40NL10T20]  (hidden comment: Capacitor 100 nF +/-10% 50 V 0603)
C65  value 10nF  [CAPC1608X90X40NL10T20]  (hidden comment: Capacitor 100 nF +/-10% 50 V 0603)
C66  value 0.1µF  [CAPC1608X90X40LL10T20]  (hidden comment: Capacitor 1 uF +/- 10% 25 V 0603)
C67  value 10nF  [CAPC1608X90X40NL10T20]  (hidden comment: Capacitor 100 nF +/-10% 50 V 0603)
C68  value 10nF  [CAPC1608X90X40NL10T20]  (hidden comment: Capacitor 100 nF +/-10% 50 V 0603)
C69  value 0.1µF  [CAPC1608X90X40LL10T20]  (hidden comment: Capacitor 1 uF +/- 10% 25 V 0603)
C70  value 10nF  [CAPC1608X90X40NL10T20]  (hidden comment: Capacitor 100 nF +/-10% 50 V 0603)
C71  value 0.1µF  [CAPC1608X90X40LL10T20]  (hidden comment: Capacitor 1 uF +/- 10% 25 V 0603)
C72  value 1µF  [CAPC1608X94X35NL15T15]  (hidden comment: Capacitor 1 uF +/- 10% 16 V 0603)
C73  value 0.1µF  [CAPC1608X90X40LL10T20]  (hidden comment: Capacitor 1 uF +/- 10% 25 V 0603)
C74  value 1µF  [CAPC1608X94X35NL15T15]  (hidden comment: Capacitor 1 uF +/- 10% 16 V 0603)
C75  value 10nF  [CAPC1608X90X40NL10T20]  (hidden comment: Capacitor 100 nF +/-10% 50 V 0603)
C76  value 0.1µF  [CAPC1608X90X40LL10T20]  (hidden comment: Capacitor 1 uF +/- 10% 25 V 0603)
C77  value 10nF  [CAPC1608X90X40NL10T20]  (hidden comment: Capacitor 100 nF +/-10% 50 V 0603)
C78  value 10nF  [CAPC1608X90X40NL10T20]  (hidden comment: Capacitor 100 nF +/-10% 50 V 0603)
C79  value 0.1µF  [CAPC1608X90X40LL10T20]  (hidden comment: Capacitor 1 uF +/- 10% 25 V 0603)
C80  value 0.1µF  [CAPC1608X90X40LL10T20]  (hidden comment: Capacitor 1 uF +/- 10% 25 V 0603)
C81  value 10nF  [CAPC1608X90X40NL10T20]  (hidden comment: Capacitor 100 nF +/-10% 50 V 0603)
C82  value 4.7µF  [CAPC0603(1608)100_L]  (hidden comment: Capacitor 4.7µF +/-20% 10V 0603)
C83  value 0.1µF  [CAPC1608X90X40LL10T20]  (hidden comment: Capacitor 1 uF +/- 10% 25 V 0603)
C84  value 10nF  [CAPC1608X90X40NL10T20]  (hidden comment: Capacitor 100 nF +/-10% 50 V 0603)
C85  value 0.1µF  [CAPC1608X90X40LL10T20]  (hidden comment: Capacitor 1 uF +/- 10% 25 V 0603)
C86  value 10nF  [CAPC1608X90X40NL10T20]  (hidden comment: Capacitor 100 nF +/-10% 50 V 0603)
C87  value 10nF  [CAPC1608X90X40NL10T20]  (hidden comment: Capacitor 100 nF +/-10% 50 V 0603)
C88  value 0.1µF  [CAPC1608X90X40LL10T20]  (hidden comment: Capacitor 1 uF +/- 10% 25 V 0603)
C89  value 10nF  [CAPC1608X90X40NL10T20]  (hidden comment: Capacitor 100 nF +/-10% 50 V 0603)
R19  value 100  [RESC0603(1608)_L]  (hidden comment: Resistor 120R +/-5 % 0603 0.1 W)
R20  value 100  [RESC0603(1608)_L]  (hidden comment: Resistor 120R +/-5 % 0603 0.1 W)
R21  value 100  [RESC0603(1608)_L]  (hidden comment: Resistor 120R +/-5 % 0603 0.1 W)
R22  value 100  [RESC0603(1608)_L]  (hidden comment: Resistor 120R +/-5 % 0603 0.1 W)
R23  value 100  [RESC0603(1608)_L]  (hidden comment: Resistor 120R +/-5 % 0603 0.1 W)
R24  value 10 M  [RESC0603(1608)_L]  (hidden comment: Resistor 120R +/-5 % 0603 0.1 W)
R25  value 10 M  [RESC0603(1608)_L]  (hidden comment: Resistor 120R +/-5 % 0603 0.1 W)
R26  value 10 M  [RESC0603(1608)_L]  (hidden comment: Resistor 120R +/-5 % 0603 0.1 W)
R27  value 10 M  [RESC0603(1608)_L]  (hidden comment: Resistor 120R +/-5 % 0603 0.1 W)
R28  value 10 M  [RESC0603(1608)_L]  (hidden comment: Resistor 120R +/-5 % 0603 0.1 W)
R29  value 10 M  [RESC0603(1608)_L]  (hidden comment: Resistor 120R +/-5 % 0603 0.1 W)
R30  value 10 M  [RESC0603(1608)_L]  (hidden comment: Resistor 120R +/-5 % 0603 0.1 W)
R31  value 10 M  [RESC0603(1608)_L]  (hidden comment: Resistor 120R +/-5 % 0603 0.1 W)
R32  value 100  [RESC0603(1608)_L]  (hidden comment: Resistor 120R +/-5 % 0603 0.1 W)
R33  value 100  [RESC0603(1608)_L]  (hidden comment: Resistor 120R +/-5 % 0603 0.1 W)
R34  value 100  [RESC0603(1608)_L]  (hidden comment: Resistor 120R +/-5 % 0603 0.1 W)
R35  value 100  [RESC0603(1608)_L]  (hidden comment: Resistor 120R +/-5 % 0603 0.1 W)
R36  value 100  [RESC0603(1608)_L]  (hidden comment: Resistor 120R +/-5 % 0603 0.1 W)
R37  value 100  [RESC0603(1608)_L]  (hidden comment: Resistor 120R +/-5 % 0603 0.1 W)
R38  value 10 M  [RESC0603(1608)_L]  (hidden comment: Resistor 120R +/-5 % 0603 0.1 W)
R39  value 10 M  [RESC0603(1608)_L]  (hidden comment: Resistor 120R +/-5 % 0603 0.1 W)
R40  value 10 M  [RESC0603(1608)_L]  (hidden comment: Resistor 120R +/-5 % 0603 0.1 W)
R41  value 10 M  [RESC0603(1608)_L]  (hidden comment: Resistor 120R +/-5 % 0603 0.1 W)
R42  value 10 M  [RESC0603(1608)_L]  (hidden comment: Resistor 120R +/-5 % 0603 0.1 W)
R43  value 10 M  [RESC0603(1608)_L]  (hidden comment: Resistor 120R +/-5 % 0603 0.1 W)
R44  value 10 M  [RESC0603(1608)_L]  (hidden comment: Resistor 120R +/-5 % 0603 0.1 W)
R45  value 10 M  [RESC0603(1608)_L]  (hidden comment: Resistor 120R +/-5 % 0603 0.1 W)
R46  value 100  [RESC0603(1608)_L]  (hidden comment: Resistor 120R +/-5 % 0603 0.1 W)
R47  value 100  [RESC0603(1608)_L]  (hidden comment: Resistor 120R +/-5 % 0603 0.1 W)
R48  value 100  [RESC0603(1608)_L]  (hidden comment: Resistor 120R +/-5 % 0603 0.1 W)
R49  value 100  [RESC0603(1608)_L]  (hidden comment: Resistor 120R +/-5 % 0603 0.1 W)
R50  value 100  [RESC0603(1608)_L]  (hidden comment: Resistor 120R +/-5 % 0603 0.1 W)
TP16  TPAD6R  [TP06R]  (no BOM)
TP17  TPAD6R  [TP06R]  (no BOM)
TP18  TPAD6R  [TP06R]  (no BOM)
TP19  TPAD6R  [TP06R]  (no BOM)
TP20  TPAD6R  [TP06R]  (no BOM)
TP21  TPAD6R  [TP06R]  (no BOM)
TP22  TPAD6R  [TP06R]  (no BOM)
TPCS1  TPAD6R  [TP06R]  (no BOM)
TPMISO1  TPAD6R  [TP06R]  (no BOM)
TPMOSI1  TPAD6R  [TP06R]  (no BOM)
TPSCLK1  TPAD6R  [TP06R]  (no BOM)
U6  AD7173-8BCPZ  [FP-CP-40-14-IPC_C]

### Ports
AIN_AD7173 (harness AD7173_AIN), SPI2_AD7173 (harness SPI)

### Harnesses
AD7173_AIN: AIN0, AIN1, AIN2, AIN3, AIN4, AIN5, AIN6, AIN7, AIN8, AIN9, AIN10, AIN11, AIN12, AIN13, AIN14, AIN15
SPI: MISO, MOSI, CS, SCLK, RefOut
SPI: MISO, MOSI, SCLK, CS, RefOut

### Nets
3.3V: C61.1 C62.1 R24.2 R25.2 R26.2 R27.2 R28.2 R29.2 R30.2 R31.2 TP19.1(TP) U6.20(IOVDD)  [project net STM32VDD]
5V: C57.1 C58.1 C79.1 C82.1 C83.1 TP18.1(TP) TP20.1(TP) U6.9(AVDD1) U6.10(AVDD2) U6.40(REF+)
GND: C55.2 C57.2 C58.2 C59.2 C60.2 C61.2 C62.2 C64.2 C65.2 C67.2 C68.2 C70.2 C71.2 C72.2 C73.2 C74.2 C75.2 C77.2 C78.2 C79.2 C81.2 C82.2 C83.2 C84.2 C86.2 C87.2 C89.2 R38.2 R39.2 R40.2 R41.2 R42.2 R43.2 R44.2 R45.2 U6.8(AVSS) U6.21(DGND) U6.39(REF-) U6.41(EP)
AIN8: R46.1 ; port AIN_AD7173.AIN11
AIN9: R37.1 ; port AIN_AD7173.AIN10
AIN10: R36.1 ; port AIN_AD7173.AIN9
AIN11: R35.1 ; port AIN_AD7173.AIN8
AIN12: R34.1 ; port AIN_AD7173.AIN7
AIN13: R33.1 ; port AIN_AD7173.AIN6
AIN14: R32.1 ; port AIN_AD7173.AIN5
AIN15: R23.1 ; port AIN_AD7173.AIN4
CS_3.3V: TPSCLK1.1(TP) U6.17(~{CS}) ; port SPI2_AD7173.CS  [project net ADC_CS_3.3V]
MISO_3.3V: TPMISO1.1(TP) U6.14(DOUT/~{RDY}) ; port SPI2_AD7173.MISO  [project net ADC_MISO_3.3V]
MOSI_3.3V: TPMOSI1.1(TP) U6.15(DIN) ; port SPI2_AD7173.MOSI  [project net ADC_MOSI_3.3V]
Refout2.5V: U6.6(REFOUT) ; port SPI2_AD7173.RefOut  [project net ADC_Refout2.5V]
SCLK_3.3V: TPCS1.1(TP) U6.16(SCLK) ; port SPI2_AD7173.SCLK  [project net ADC_SCLK_3.3V]
NetC55_1: C55.1 C56.1 R19.2 R24.1 TP16.1(TP) U6.2(AIN0/REF2-)
NetC56_2: C56.2 C59.1 R20.2 R38.1 TP17.1(TP) U6.3(AIN1/REF2+)
NetC60_1: C60.1 C63.1 R21.2 R25.1 U6.4(AIN2)
NetC63_2: C63.2 C64.1 R22.2 R39.1 U6.5(AIN3)
NetC65_1: C65.1 C66.1 R23.2 R26.1 U6.26(AIN4)
NetC66_2: C66.2 C67.1 R32.2 R40.1 U6.27(AIN5)
NetC68_1: C68.1 C69.1 R27.1 R33.2 U6.28(AIN6)
NetC69_2: C69.2 C70.1 R34.2 R41.1 U6.29(AIN7)
NetC71_1: C71.1 C72.1 U6.7(REGCAPA)
NetC73_1: C73.1 C74.1 U6.22(REGCAPD)
NetC75_1: C75.1 C76.1 R28.1 R35.2 U6.30(AIN8)
NetC76_2: C76.2 C77.1 R36.2 R42.1 U6.31(AIN9)
NetC78_1: C78.1 C80.1 R29.1 R37.2 U6.32(AIN10)
NetC80_2: C80.2 C81.1 R43.1 R46.2 U6.33(AIN11)
NetC84_1: C84.1 C85.1 R30.1 R47.2 U6.34(AIN12)
NetC85_2: C85.2 C86.1 R44.1 R48.2 U6.35(AIN13)
NetC87_1: C87.1 C88.1 R31.1 R49.2 TP21.1(TP) U6.36(AIN14)
NetC88_2: C88.2 C89.1 R45.1 R50.2 TP22.1(TP) U6.37(AIN15)
NetJADC1_14: R22.1 ; port AIN_AD7173.AIN3
NetJADC1_15: R21.1 ; port AIN_AD7173.AIN2
NetJADC1_17: R20.1 ; port AIN_AD7173.AIN1
NetJADC1_18: R19.1 ; port AIN_AD7173.AIN0
NetJADC1_20: R50.1 ; port AIN_AD7173.AIN15
NetJADC1_21: R49.1 ; port AIN_AD7173.AIN14
NetJADC1_23: R48.1 ; port AIN_AD7173.AIN13
NetJADC1_24: R47.1 ; port AIN_AD7173.AIN12

Not connected (* = marked no-connect by the designer): U6 1(AIN16)* 11(PDSW)* 12(XTAL1)* 13(XTAL2/CLKIO)* 18(~{ERROR})* 19(~{SYNC})* 23(GPIO0)* 24(GPIO1)* 25(GPO2)* 38(GPO3)*

### Notes on the sheet
- (near R24) DNP
- (near R25) DNP
- (near R26) DNP
- (near R27) DNP
- (near R28) DNP
- (near R29) DNP
- (near R30) DNP
- (near R31) DNP
- (near R38) DNP
- (near R39) DNP
- (near R40) DNP
- (near R41) DNP
- (near R42) DNP
- (near R43) DNP
- (near R44) DNP
- (near R45) DNP
- SPI Bus
- DWG. NO.
- REV.
- SHT.
- THIS DOCUMENT AND THE DATA DISCLOSED HEREIN OR HEREWITH IS THE PROPERTY OF ALTIUM LIMITED AND MAY BE FREELY DISTRIBUTED IN WHOLE. NO RIGHTS ARE RESERVED OR EXPRESS OR IMPLIED WARANTEE GIVEN.
- REVISION
- DESCRIPTION
- DATE
- APPROVED
- ENG:
- APPROVALS
- PROJECT
- DSN:
- CHK:
- REFERENCE DOCUMENTS
- PROJECT REVISION:
- TITLE
- DOCUMENT REVISION:
- DESIGN ITEM:
- BOM:
- FAB DWG:
- PCB DWG:
- ASSY DWG:
- SCALE:
- SIZE
- B
- CAGE CODE
- FILE NAME
- DWG NO.
- SHEET
- OF
- REV

### Library data of the parts
C55 C58-C60 C62 C64 C65 C67 C68 C70 C75 C77 C78 C81 C84 C86 C87 C89 = CMP-001-00017-6: as C45 on sheet STM32; Tolerance: 10%; Mounting Technology: SM; Max Operating Temperature: 125°C; RoHS Compliant: True; Pins: 2; Case/Package: 0603; Min Operating Temperature: -55°C
C56 C57 C61 C63 C66 C69 C71 C73 C76 C79 C80 C83 C85 C88 = CMP-001-00005-6: as C44 on sheet STM32; Pins: 2; Mounting Technology: SM; RoHS Compliant: True; Max Operating Temperature: 125°C; Case/Package: 0603; Min Operating Temperature: -55°C; Tolerance: 10%
C72 C74 = CMP-001-00003-6: Chip Capacitor, 1 uF, +/- 10%, 16 V, 0603 (1608 Metric); Voltage Rating: 16V; Capacitor Type: Ceramic; Max Operating Temperature: 125°C; Pins: 2; Tolerance: 10%; Min Operating Temperature: -55°C; RoHS Compliant: True; Mounting Technology: SM; Case/Package: 0603
C82 = CMP-001-00076-4: Chip Capacitor, 4.7µF +/-20%, 10V, 0603, Thickness 1 mm; Tolerance: 10%; Mounting Technology: SMT; Case/Package: 0603; Pins: 2; Min Operating Temperature: -55°C; Max Operating Temperature: 85°C; Voltage Rating: 10V
R19-R50 = CMP-009-00176-3: Chip Resistor, 120 Ohms, +/-5 %, 0.1 W, -55 to 155 degC, 0603; Power: 100mW; Tolerance: 5%; Max Operating Temperature: 155°C; Pins: 2; Case/Package: 0603; Min Operating Temperature: -55°C
TP16-TP22 TPCS1 TPMISO1 TPMOSI1 TPSCLK1 = CMP-00028-00002-2: 0.6mm round; Pins: 1
U6 = CMP-09081-000008-1: IC ADC 24BIT SIGMA-DELTA 40LFCSP; Max Power Dissipation: 28mW; Interface: SPI; Number of A/D Converters: 1; Min Input Voltage: 2.5V; Max Supply Voltage: 5.5V; Min Supply Voltage: 2V; Operating Supply Voltage: 5V; Nominal Supply Current: 2.12mA; Number of Channels: 16; Number of Bits: 24; Output Type: TTL; Power Dissipation: 9.96mW; Sampling Rate: 31.25KS/s; Supply Type: Single; Polarity: Bipolar; Resolution: 24b; Number of Pins: 40; Max Input Voltage: 2.5V; Reference Voltage: 2.5V; Package Quantity: 490; Packaging: Tray; Lead Free: Contains Lead; Min Operating Temperature: -40°C; Mount: Surface Mount; Max Operating Temperature: 105°C; Length: 6.1mm; Contact Plating: Tin; Number of Converters: 1; Case/Package: LFCSP EP; Height: 0.75mm; Width: 6.1mm; Number of Elements: 1; REACH SVHC: No SVHC

## Sheet FlashMemorySchDoc.SchDoc
size A; SheetNumber: 10; SheetTotal: 13
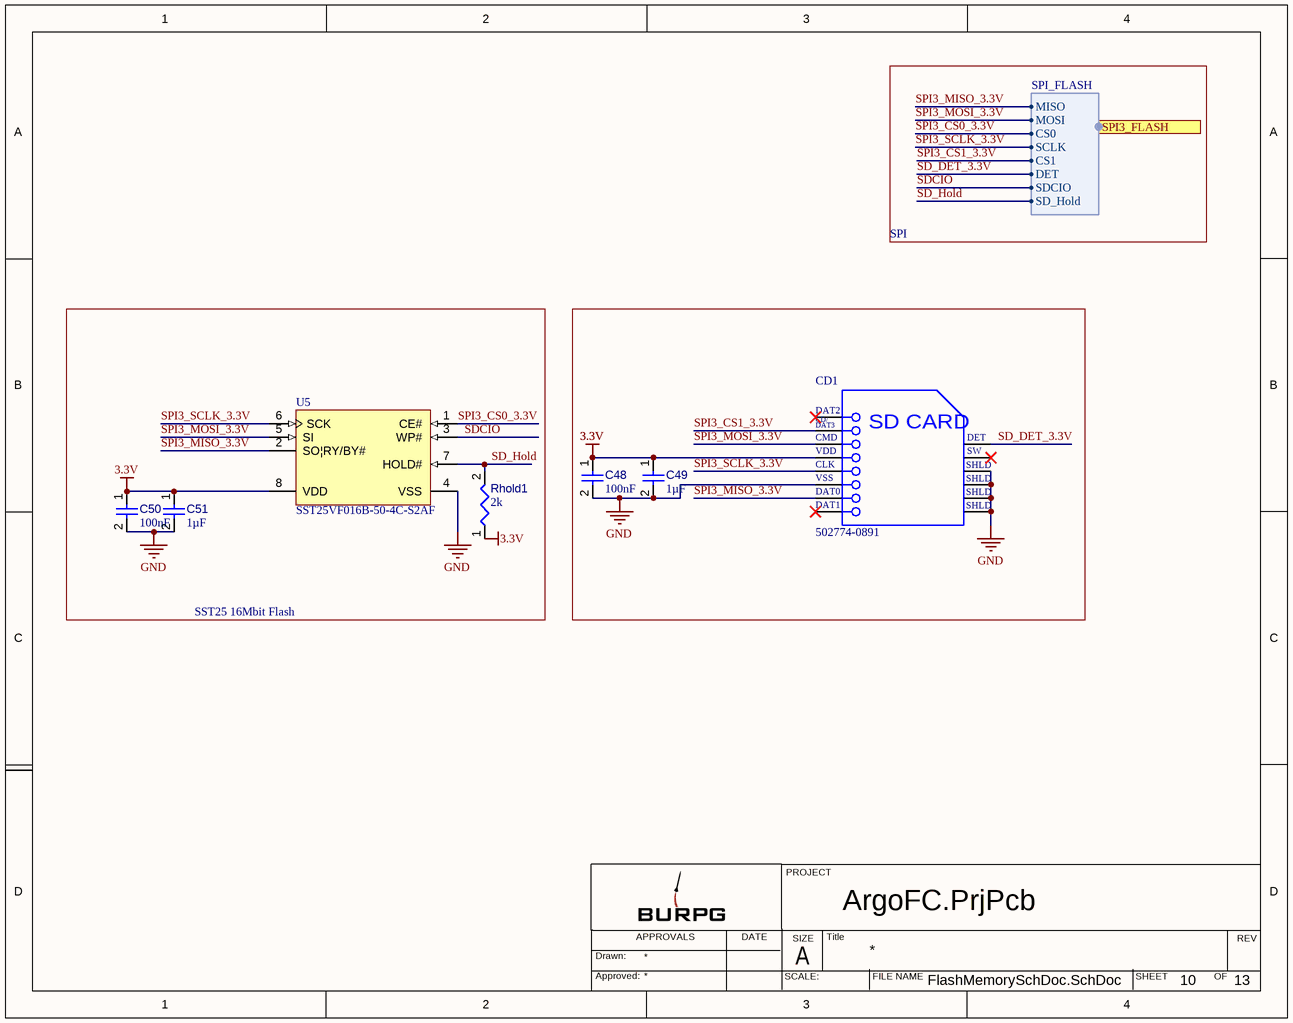
[diagram p5: FlashMemorySchDoc.SchDoc]

### Parts
C48  value 100nF  [CAPC0402(1005)60_L]  (hidden comment: Capacitor 100nF +/-20% 25V 0402)
C49  value 1µF  [CAPC1608X94X35NL15T15]  (hidden comment: Capacitor 1 uF +/- 10% 16 V 0603)
C50  value 100nF  [CAPC0402(1005)60_L]  (hidden comment: Capacitor 100nF +/-20% 25V 0402)
C51  value 1µF  [CAPC1608X94X35NL15T15]  (hidden comment: Capacitor 1 uF +/- 10% 16 V 0603)
CD1  502774-0891  [MOLX-502774-0891_V]
Rhold1  value 2k  [RESC0402(1005)_L]  (hidden comment: Resistor 2K +/-5 % 0402 63 mW)
U5  SST25VF016B-50-4C-S2AF  [MCHP-SOIC-S2A8_M]

### Blocks framed on the sheet
SST25 16Mbit Flash: C50 C51 Rhold1 U5

### Ports
SPI3_FLASH (harness SPI_FLASH)

### Harnesses
SPI_FLASH: MISO, MOSI, CS0, SCLK, CS1, DET, SDCIO, SD_Hold

### Nets
3.3V: C48.1 C49.1 C50.1 C51.1 CD1.4(VDD) Rhold1.1 U5.8(VDD)  [project net STM32VDD]
GND: C48.2 C49.2 C50.2 C51.2 CD1.6(VSS) CD1.11(SHLD) CD1.12(SHLD) CD1.13(SHLD) CD1.14(SHLD) U5.4(VSS)
SD_DET_3.3V: CD1.9(DETECT) ; port SPI3_FLASH.DET
SD_Hold: Rhold1.2 U5.7(HOLD#) ; port SPI3_FLASH.SD_Hold
SDCIO: U5.3(WP#) ; port SPI3_FLASH.SDCIO
SPI3_CS0_3.3V: U5.1(CE#) ; port SPI3_FLASH.CS0
SPI3_CS1_3.3V: CD1.2(CD/DAT3) ; port SPI3_FLASH.CS1
SPI3_MISO_3.3V: CD1.7(DAT0) U5.2(SO|RY/BY#) ; port SPI3_FLASH.MISO
SPI3_MOSI_3.3V: CD1.3(CMD) U5.5(SI) ; port SPI3_FLASH.MOSI
SPI3_SCLK_3.3V: CD1.5(CLK) U5.6(SCK) ; port SPI3_FLASH.SCLK

Not connected (* = marked no-connect by the designer): CD1 1(DAT2)* 8(DAT1)* 10(SWITCH)*

### Notes on the sheet
- SPI
- PROJECT
- Drawn:
- Approved:
- APPROVALS
- DATE
- SCALE:
- SIZE
- A
- Title
- FILE NAME
- SHEET
- OF
- REV
- (in symbol CMP-2000-05248-1) CD/; DAT3; SD CARD; DET; SW

### Library data of the parts
C48 C50 = CMP-001-00065-4: Chip Capacitor, 100nF +/-20%, 25V, 0402, Thickness 0.6 mm; Tolerance: 10%; Max Operating Temperature: 85°C; Min Operating Temperature: -55°C; Pins: 2; Voltage Rating: 25V; Mounting Technology: SMT; Case/Package: 0402
C49 C51 = CMP-001-00003-6: as C72 on sheet AD7173adcModule; Max Operating Temperature: 125°C; Pins: 2; Tolerance: 10%; Min Operating Temperature: -55°C; RoHS Compliant: True; Mounting Technology: SM; Case/Package: 0603
CD1 = CMP-2000-05248-1: Micro SD Memory Card Connector, 0.5 A, 10 V (DC), -25 to 85 degC, 8-Pin SMT, RoHS, Tape and Reel; Manufacturer: Molex; 3D Model: 502774-0891.stp; Online Catalog: microSD™Series; Number of Positions: 10(8+2); Card Type: SecureDigital-microSD™; Insertion, Removal Method: PushIn,PushOut; Other Names: WM24066DKR; Connector Type: ConnectorandEjector; Features: Switch; Family: MemoryConnectors-PCCardSockets; Manufacturer URL: http://www.molex.com/; Mounting Type: SurfaceMount,RightAngle; Contact Finish Thickness: 20µin(0.51µm); Standard Package: 1; Series: 502774; Ejector Side: -; Datasheet Version: Rev. D, 04/2004; Category: Connectors,Interconnects; Contact Finish: Gold; Datasheet URL: https://datasheet.ciiva.com/1104/1499551-1104671.pdf; RoHS Information: 502774-0891CertofCompliance; Mounting Feature: Reverse-Bottom; Packaging: Digi-Reel; Height Above Board: 0.071"(1.80mm); Catalog Drawings: 502774-0891
Rhold1 = CMP-009-00138-3: Chip Resistor, 2 kOhms, +/-5 %, 63 mW, -55 to 155 degC, 0402; Tolerance: 5%; Power: 63mW; Max Operating Temperature: 155°C; Pins: 2; Min Operating Temperature: -55°C; Case/Package: 0402
U5 = CMP-0378-00041-1: 16 Mbit SPI Serial Flash, 2.7 to 3.6 V, 50 MHz, 0 to 70 degC, 8-pin SOIC (S2A8), Tube; Manufacturer: Microchip; PackageReference: SOIC-S2A8; PackageVersion: Rev. A; ComponentLink3URL: http://ww1.microchip.com/downloads/en/DeviceDoc/25051A.pdf; ComponentLink1Description: Manufacturer URL; ComponentLink4URL: http://www.microchip.com/SST25VF016B; ComponentLink1URL: http://www.microchip.com; DatasheetVersion: Rev. A; ComponentLink2URL: http://ww1.microchip.com/downloads/en/DeviceDoc/25044A.pdf; PackageDescription: 8-Lead Plastic Small Outline Intergrated Circuit, 5.275 x 5.275 mm Body, 1.27 mm Pitch; PartNumber: SST25VF016B-50-4C-S2AF; ComponentLink3Description: Package Specification; ComponentLink2Description: Datasheet; Mounting Technology: Surface Mount; ComponentLink4Description: Product URL

## Sheet LoadSwitches.SchDoc: Load Switches
size A; SheetNumber: 10; SheetTotal: 13
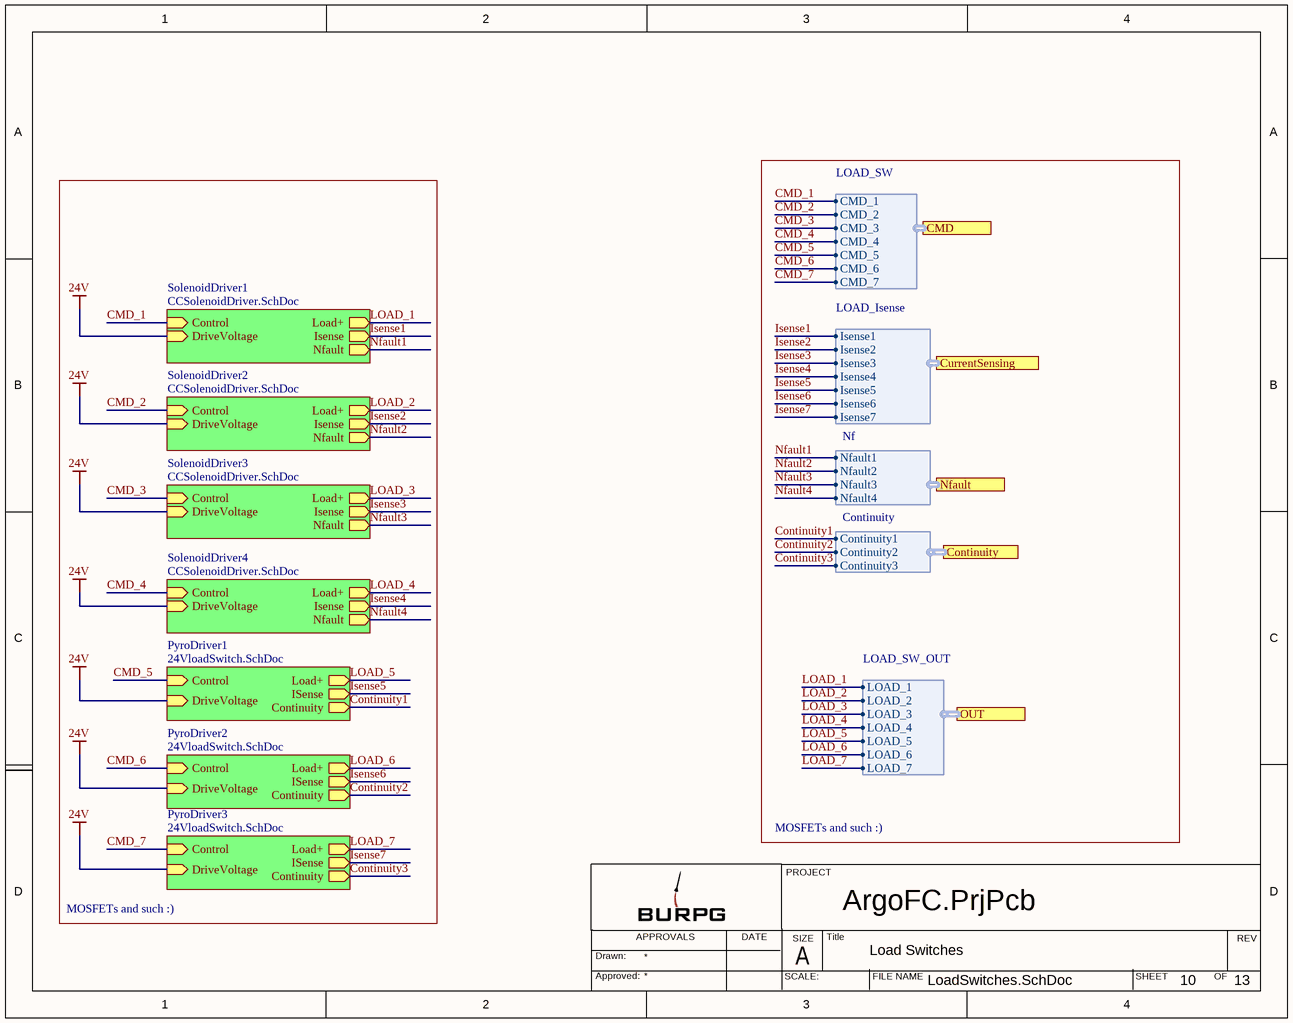
[diagram p6: LoadSwitches.SchDoc]

### Sub-sheets
PyroDriver1 = 24VloadSwitch.SchDoc: Load+ (out), Control (in), ISense (out), DriveVoltage (in), Continuity (out)
PyroDriver2 = 24VloadSwitch.SchDoc: Load+ (out), Control (in), ISense (out), DriveVoltage (in), Continuity (out)
PyroDriver3 = 24VloadSwitch.SchDoc: Load+ (out), Control (in), ISense (out), DriveVoltage (in), Continuity (out)
SolenoidDriver1 = CCSolenoidDriver.SchDoc: Load+ (out), Control (in), Isense (out), Nfault (out), DriveVoltage (in)
SolenoidDriver2 = CCSolenoidDriver.SchDoc: Load+ (out), Isense (out), Control (in), Nfault (out), DriveVoltage (in)
SolenoidDriver3 = CCSolenoidDriver.SchDoc: Load+ (out), Control (in), DriveVoltage (in), Isense (out), Nfault (out)
SolenoidDriver4 = CCSolenoidDriver.SchDoc: Load+ (out), Control (in), DriveVoltage (in), Isense (out), Nfault (out)

### Ports
CMD (harness LOAD_SW), Continuity (harness Continuity), CurrentSensing (harness LOAD_Isense), Nfault (harness Nf), OUT (harness LOAD_SW_OUT)

### Harnesses
LOAD_SW: CMD_1, CMD_2, CMD_3, CMD_4, CMD_5, CMD_6, CMD_7
LOAD_SW_OUT: LOAD_1, LOAD_2, LOAD_3, LOAD_4, LOAD_5, LOAD_6, LOAD_7
LOAD_Isense: Isense1, Isense2, Isense3, Isense4, Isense5, Isense6, Isense7
Nf: Nfault1, Nfault2, Nfault3, Nfault4
Continuity: Continuity1, Continuity2, Continuity3

### Nets
24V: sheet SolenoidDriver1/DriveVoltage, sheet SolenoidDriver2/DriveVoltage, sheet SolenoidDriver3/DriveVoltage, sheet SolenoidDriver4/DriveVoltage, sheet PyroDriver1/DriveVoltage, sheet PyroDriver2/DriveVoltage, sheet PyroDriver3/DriveVoltage  [project net 24Vin]
CMD_1: sheet SolenoidDriver1/Control, port CMD.CMD_1
CMD_2: sheet SolenoidDriver2/Control, port CMD.CMD_2
CMD_3: sheet SolenoidDriver3/Control, port CMD.CMD_3
CMD_4: sheet SolenoidDriver4/Control, port CMD.CMD_4
CMD_5: sheet PyroDriver1/Control, port CMD.CMD_5
CMD_6: sheet PyroDriver2/Control, port CMD.CMD_6
CMD_7: sheet PyroDriver3/Control, port CMD.CMD_7
Continuity1: sheet PyroDriver1/Continuity, port Continuity.Continuity1
Continuity2: sheet PyroDriver2/Continuity, port Continuity.Continuity2
Continuity3: sheet PyroDriver3/Continuity, port Continuity.Continuity3
Isense1: sheet SolenoidDriver1/Isense, port CurrentSensing.Isense1
Isense2: sheet SolenoidDriver2/Isense, port CurrentSensing.Isense2
Isense3: sheet SolenoidDriver3/Isense, port CurrentSensing.Isense3
Isense4: sheet SolenoidDriver4/Isense, port CurrentSensing.Isense4
Isense5: sheet PyroDriver1/ISense, port CurrentSensing.Isense5
Isense6: sheet PyroDriver2/ISense, port CurrentSensing.Isense6
Isense7: sheet PyroDriver3/ISense, port CurrentSensing.Isense7
LOAD_1: sheet SolenoidDriver1/Load+, port OUT.LOAD_1
LOAD_2: sheet SolenoidDriver2/Load+, port OUT.LOAD_2
LOAD_3: sheet SolenoidDriver3/Load+, port OUT.LOAD_3
LOAD_4: sheet SolenoidDriver4/Load+, port OUT.LOAD_4
LOAD_5: sheet PyroDriver1/Load+, port OUT.LOAD_5
LOAD_6: sheet PyroDriver2/Load+, port OUT.LOAD_6
LOAD_7: sheet PyroDriver3/Load+, port OUT.LOAD_7
Nfault1: sheet SolenoidDriver1/Nfault, port Nfault.Nfault1
Nfault2: sheet SolenoidDriver2/Nfault, port Nfault.Nfault2
Nfault3: sheet SolenoidDriver3/Nfault, port Nfault.Nfault3
Nfault4: sheet SolenoidDriver4/Nfault, port Nfault.Nfault4

### Notes on the sheet
- MOSFETs and such :)
- PROJECT
- Drawn:
- Approved:
- APPROVALS
- DATE
- SCALE:
- SIZE
- A
- Title
- FILE NAME
- SHEET
- OF
- REV

## Sheet CCSolenoidDriver.SchDoc
size A4; SheetNumber: 13; SheetTotal: 13
Used 4 times, as channels U_TopSheet/U_LoadSwitches/SolenoidDriver1, U_TopSheet/U_LoadSwitches/SolenoidDriver2, U_TopSheet/U_LoadSwitches/SolenoidDriver3, U_TopSheet/U_LoadSwitches/SolenoidDriver4. Parts and nets are listed once, with the designators drawn on the sheet.
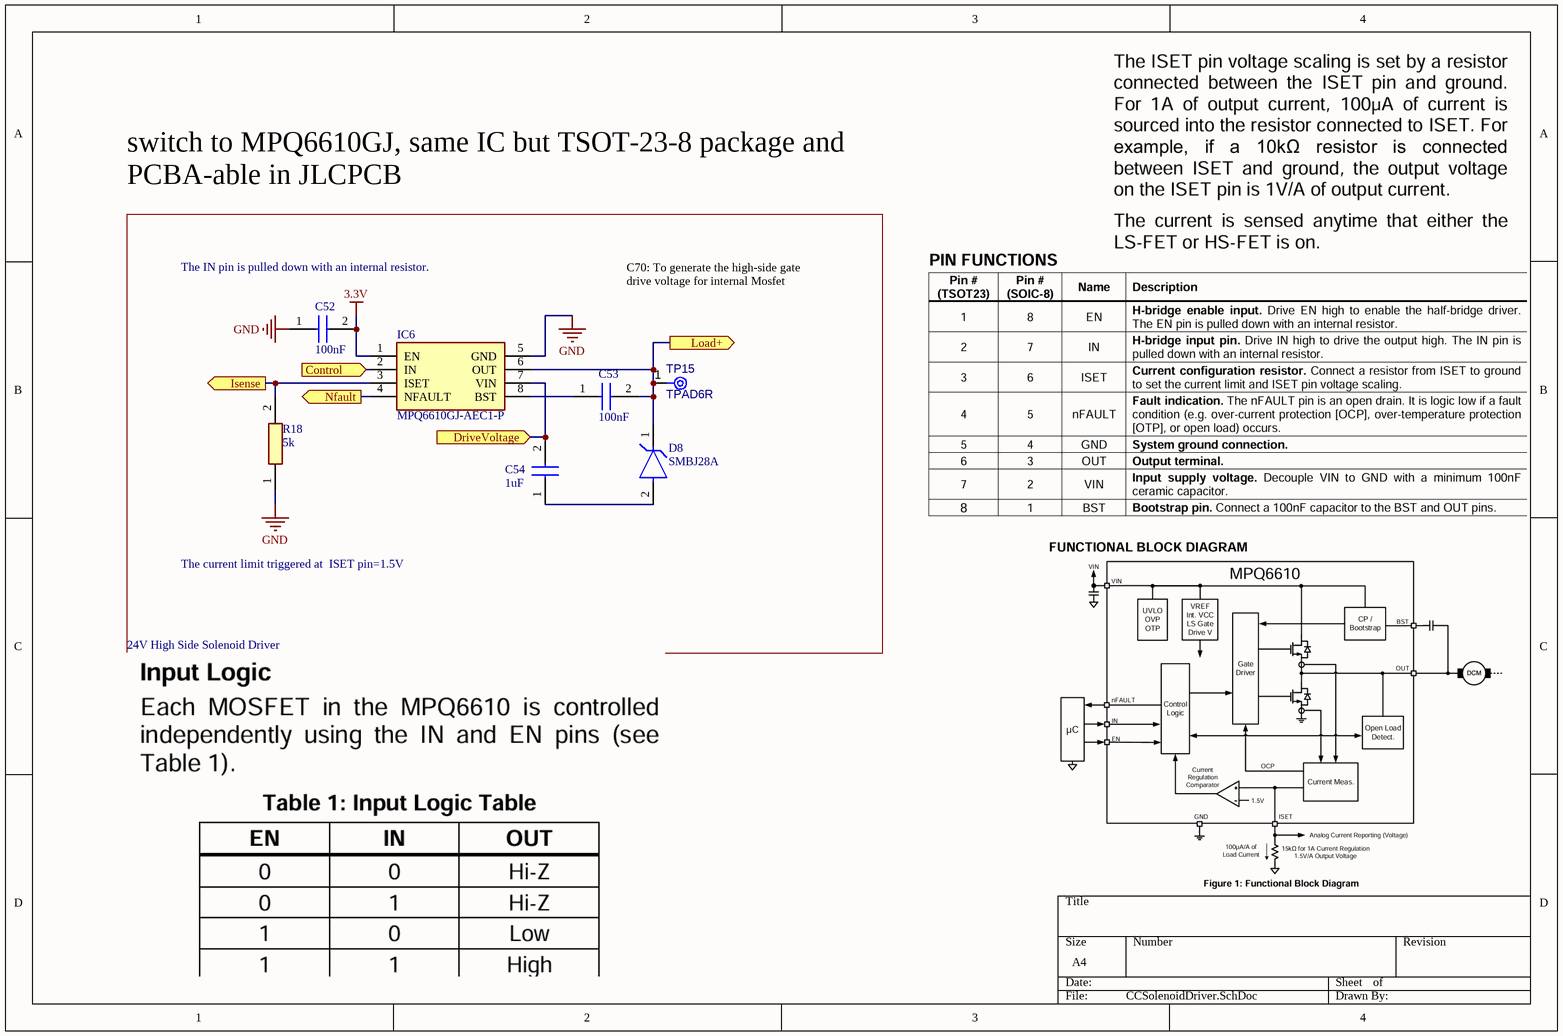
[diagram p7: CCSolenoidDriver.SchDoc]

### Parts
C52  100nF  [CAPC1608X90N]
C53  100nF  [CAPC1608X90N]
C54  1uF  [CAPC3216X180N]
D8  SMBJ28A  [FP-SMBJ-MFG]
IC6  MPQ6610GJ-AEC1-P  [SOT65P280X100-8N]
R18  5k  [RESC1608X55N]
TP15  TPAD6R  [TP06R]  (no BOM)

### Ports
Control (in), DriveVoltage (in), Isense (out), Load+ (out), Nfault (out)

### Nets
3.3V: C52.2 IC6.1(EN)
GND: C52.1 IC6.5(GND) R18.1
Control: IC6.2(IN) ; port Control
DriveVoltage: C54.2 IC6.7(VIN) ; port DriveVoltage
Isense: IC6.3(ISET) R18.2 ; port Isense
Load+: C53.2 D8.1(C) IC6.6(OUT) TP15.1(TP) ; port Load+
Nfault: IC6.4(NFAULT) ; port Nfault
NetC53_1: C53.1 IC6.8(BST)
NetC54_1: C54.1 D8.2(A)

### Channels
U_TopSheet/U_LoadSwitches/SolenoidDriver1: designators C52=C52_1 C53=C54_1 C54=C55_1 D8=D8_1 IC6=IC6_1 R18=R18_1 TP15=TP15_1; ports Control=CMD_1 DriveVoltage=24Vin Isense=Isense1 Load+=LOAD_1 Nfault=Nfault1
U_TopSheet/U_LoadSwitches/SolenoidDriver2: designators C52=C52_2 C53=C54_2 C54=C55_2 D8=D8_2 IC6=IC6_2 R18=R18_2 TP15=TP15_2; ports Control=CMD_2 DriveVoltage=24Vin Isense=Isense2 Load+=LOAD_2 Nfault=Nfault2
U_TopSheet/U_LoadSwitches/SolenoidDriver3: designators C52=C52_3 C53=C54_3 C54=C55_3 D8=D8_3 IC6=IC6_3 R18=R18_3 TP15=TP15_3; ports Control=CMD_3 DriveVoltage=24Vin Isense=Isense3 Load+=LOAD_3 Nfault=Nfault3
U_TopSheet/U_LoadSwitches/SolenoidDriver4: designators C52=C52_4 C53=C54_4 C54=C55_4 D8=D8_4 IC6=IC6_4 R18=R18_4 TP15=TP15_4; ports Control=CMD_4 DriveVoltage=24Vin Isense=Isense4 Load+=LOAD_4 Nfault=Nfault4

### Notes on the sheet
- switch to MPQ6610GJ, same IC but TSOT-23-8 package and PCBA-able in JLCPCB
- The IN pin is pulled down with an internal resistor.
- C70: To generate the high-side gate drive voltage for internal Mosfet
- The current limit triggered at  ISET pin=1.5V
- 24V High Side Solenoid Driver

### Library data of the parts
C52 C53 = CC0603KRX7R9BB104: Capacitor,0603, 50V; Manufacturer_Name: YAGEO; Datasheet Link: https://componentsearchengine.com/Datasheets/2/CC0603KRX7R9BB104.pdf; Height: 0.9mm; Manufacturer_Part_Number: CC0603KRX7R9BB104; Mouser Part Number: 603-CC603KRX7R9BB104; Mouser Price/Stock: https://www.mouser.co.uk/ProductDetail/YAGEO/CC0603KRX7R9BB104?qs=vTakOoo5QyLvVCYM2ge8LQ%3D%3D; Arrow Part Number: CC0603KRX7R9BB104; Arrow Price/Stock: https://www.arrow.com/en/products/cc0603krx7r9bb104/yageo?utm_currency=USD&region=europe
C54 = CL31B105KBHNNNE: 1uF,1206, 50v; Manufacturer_Name: SAMSUNG; Datasheet Link: https://datasheet.datasheetarchive.com/originals/distributors/Datasheets_SAMA/5cd9a1c15dad09a7278f50cb1a2e4a6e.pdf; Height: 1.8mm; Manufacturer_Part_Number: CL31B105KBHNNNE; Mouser Part Number: 187-CL31B105KBHNNNE; Mouser Price/Stock: https://www.mouser.co.uk/ProductDetail/Samsung-Electro-Mechanics/CL31B105KBHNNNE?qs=349EhDEZ59oPJzVuH4J5mw%3D%3D; Arrow Part Number: CL31B105KBHNNNE; Arrow Price/Stock: https://www.arrow.com/en/products/cl31b105kbhnnne/samsung-electro-mechanics?utm_currency=USD&region=europe
D8 = CMP-08607-000081-1: TVS DIODE 28V 45.4V DO214AA; Manufacturer: Littelfuse Inc; Breakdown Voltage: 31.1V; Direction: Unidirectional; Number Of Channels: 1; Peak Pulse Power: 600W; Max Junction Temp: +150°C; Peak Pulse Current: 13.3A; Temperature: -65°C to +150°C; Category: Diode; RoHS: TRUE; Height: 2.61mm; Reverse Standoff Voltage: 28V; Device Class L1: Circuit Protection; Temperature Range Low: -65°C; ComponentLink2Description: Datasheet; Digikey Description: TVS DIODE 28V 45.4V DO214AA; Automotive: No; Package: SMBJ; Mouser Description: Littelfuse SMBJ28A, Uni-Directional TVS Diode, 600W, 2-Pin DO-214AA; ComponentLink2URL: https://www.littelfuse.com/~/media/electronics/datasheets/tvs_diodes/littelfuse_tvs_diode_smbj_datasheet.pdf.pdf; Manufacturer Part Number: SMBJ28A; Octopart: https://octopart.com/smbj28a-littelfuse-350790; Clamping Voltage: 45.4V; Temperature Range High: +150°C; Device Class L3: unset; Device Class L2: TVS Diodes; Lead Free: Yes
IC6 = CMP-031-00027-1: Integrated Circuit; Manufacturer_Name: Monolithic Power Systems (MPS); Height: 1mm; Manufacturer_Part_Number: MPQ6610GJ-AEC1-P; Design Item ID: MPQ6610GJ-AEC1-P; Datasheet Link: https://www.monolithicpower.com/en/documentview/productdocument/index/version/2/document_type/Datasheet/lang/en/sku/MPQ6610-AEC1/document_id/9806/; Source: SamacSys.SchLib
R18 = 0603WAF5101T5E: 0603 5K resistor, Pick based component in JLCPCB lib; Manufacturer_Name: UNI-ROYAL(Uniroyal Elec); Datasheet Link: https://datasheet.lcsc.com/szlcsc/Uniroyal-Elec-0603WAF5101T5E_C23186.pdf; Height: 0.55mm; Manufacturer_Part_Number: 0603WAF5101T5E
TP15 = CMP-00028-00002-2: 0.6mm round; Pins: 1